# EAGLE board fmc-to-vhcdi (EAGLE 8.3.2), part 1 of 2
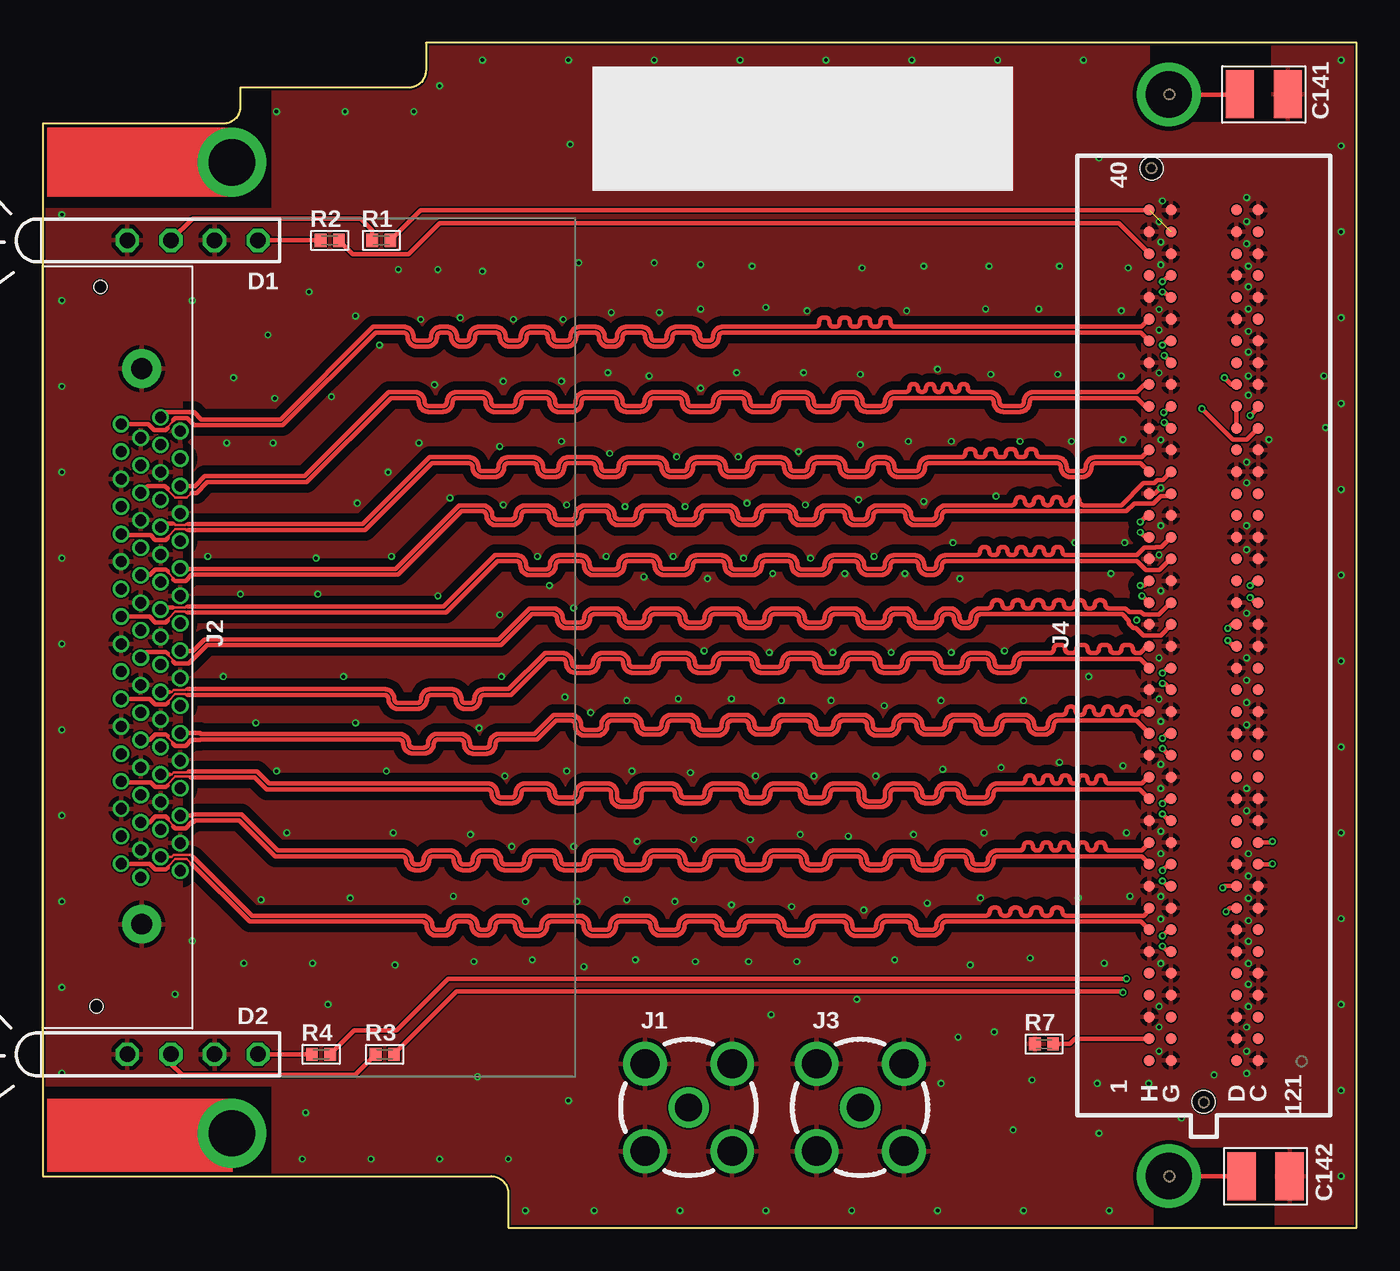
[diagram p2: board, top side]
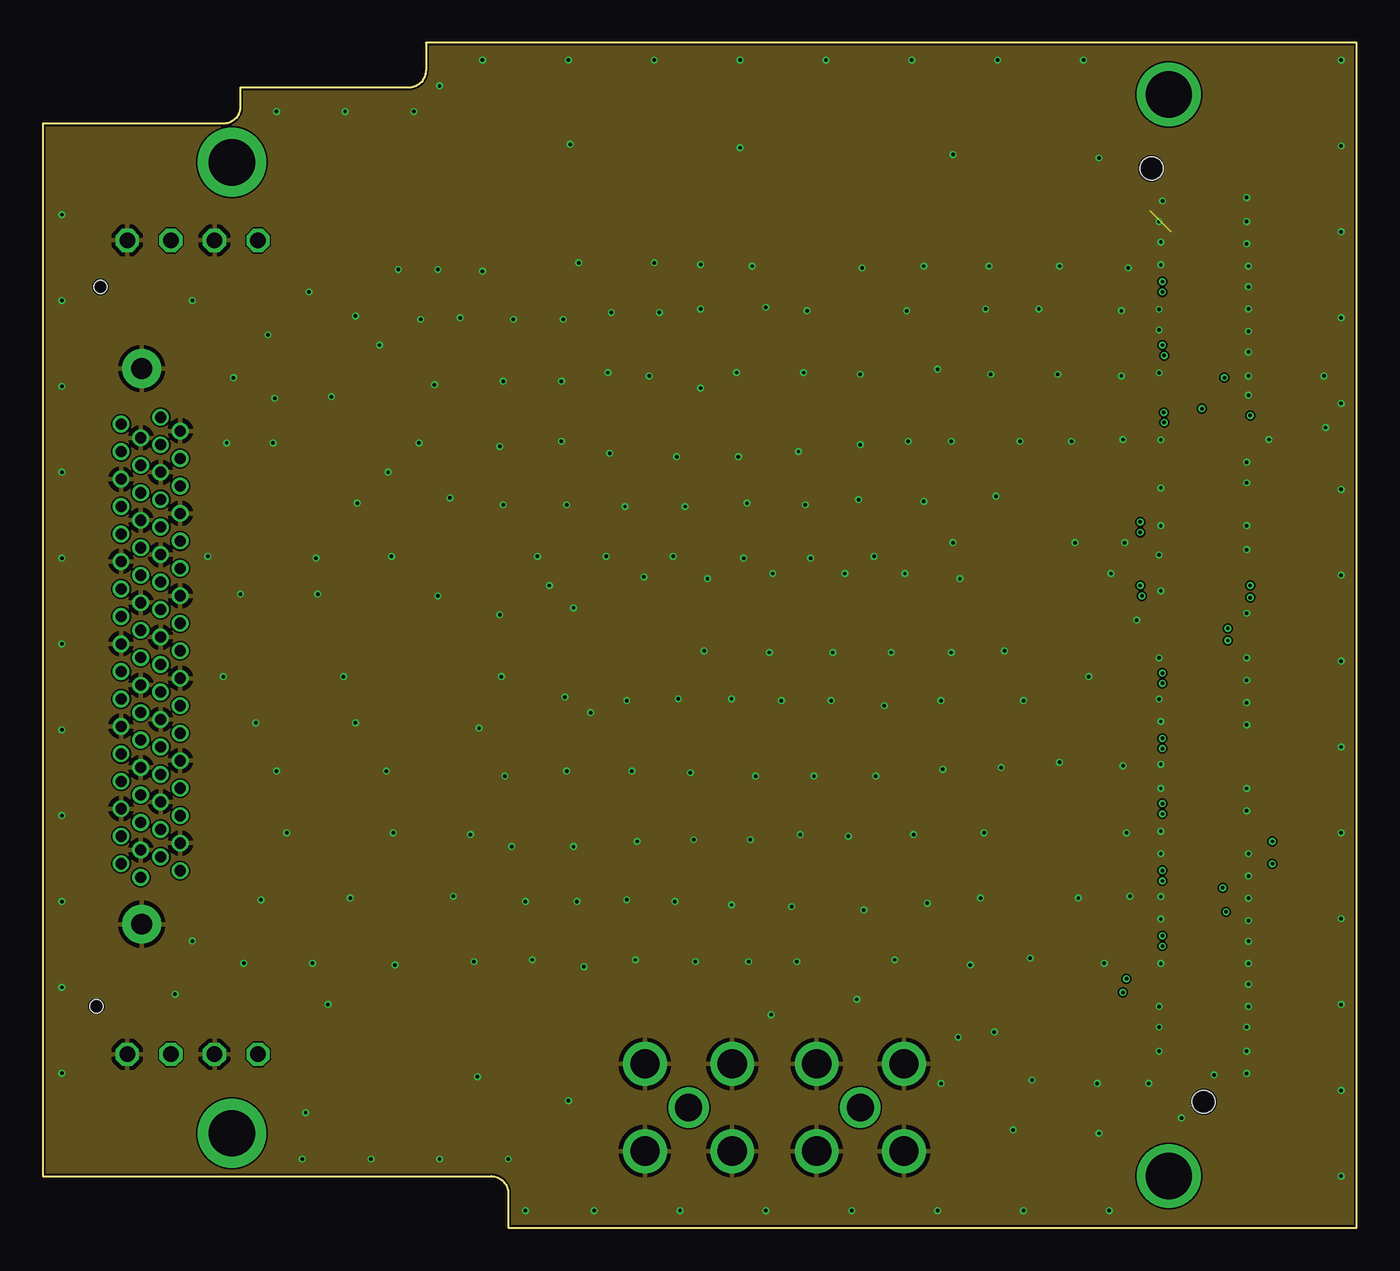
[diagram p3: board, inner layer GND1]
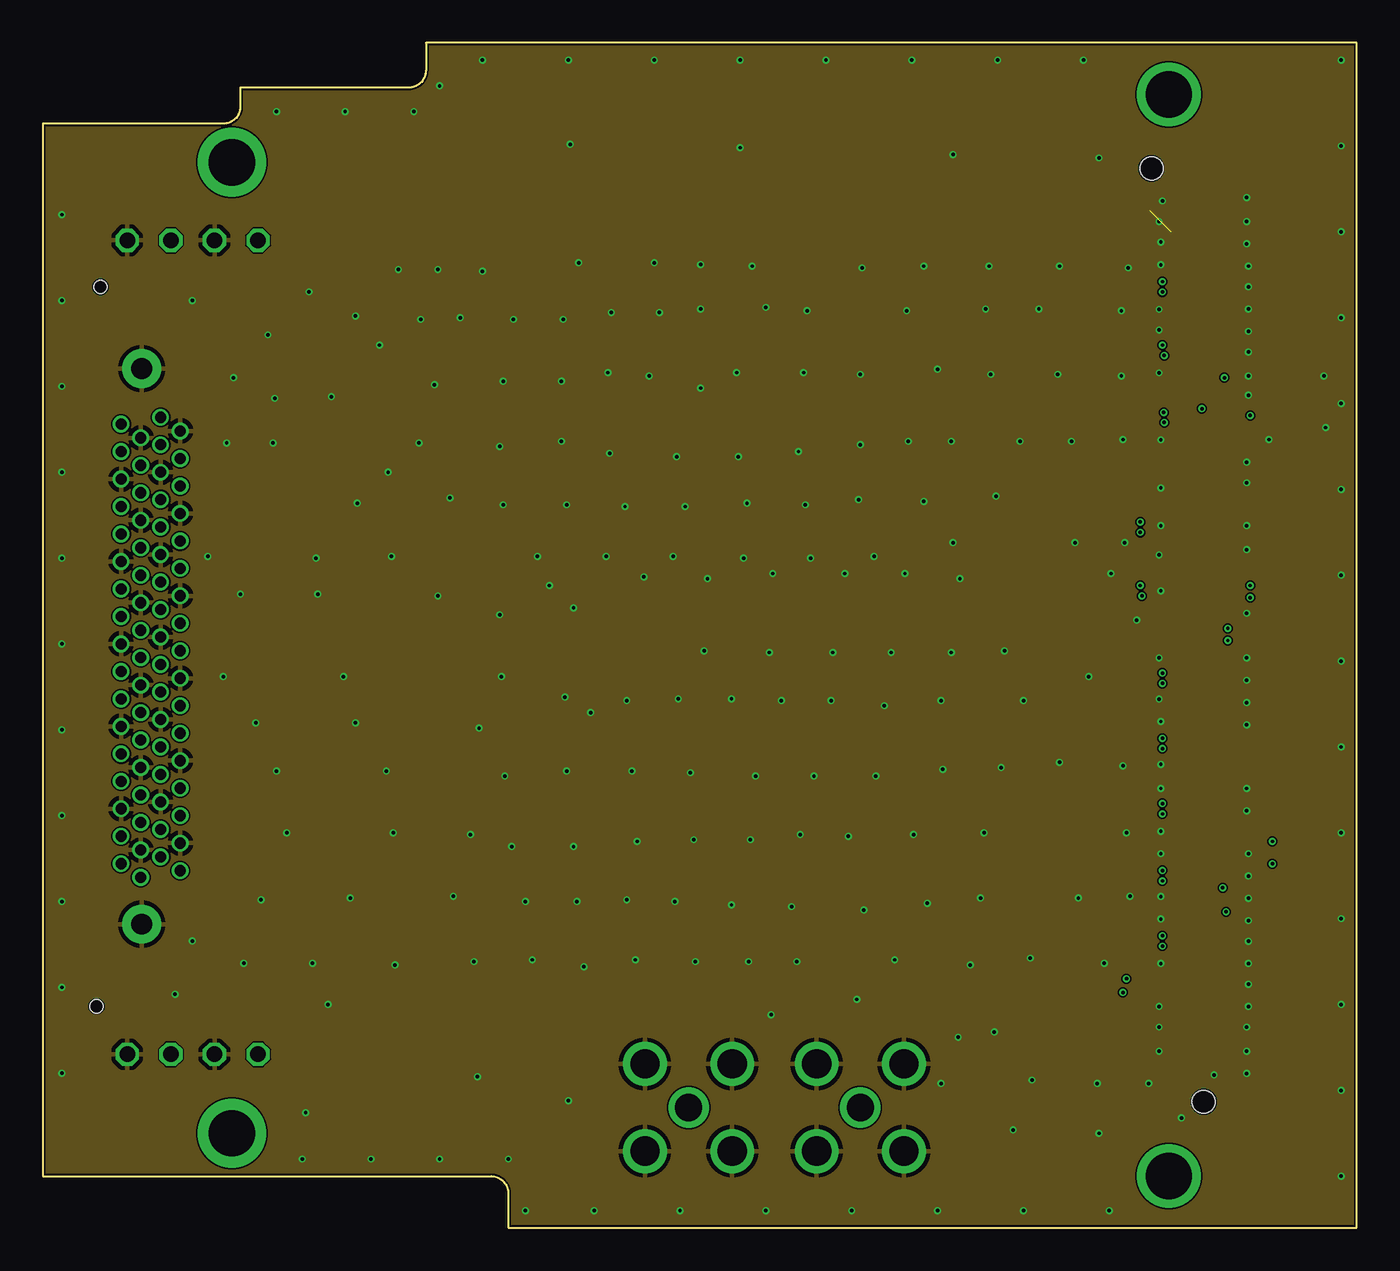
[diagram p4: board, inner layer GND2]
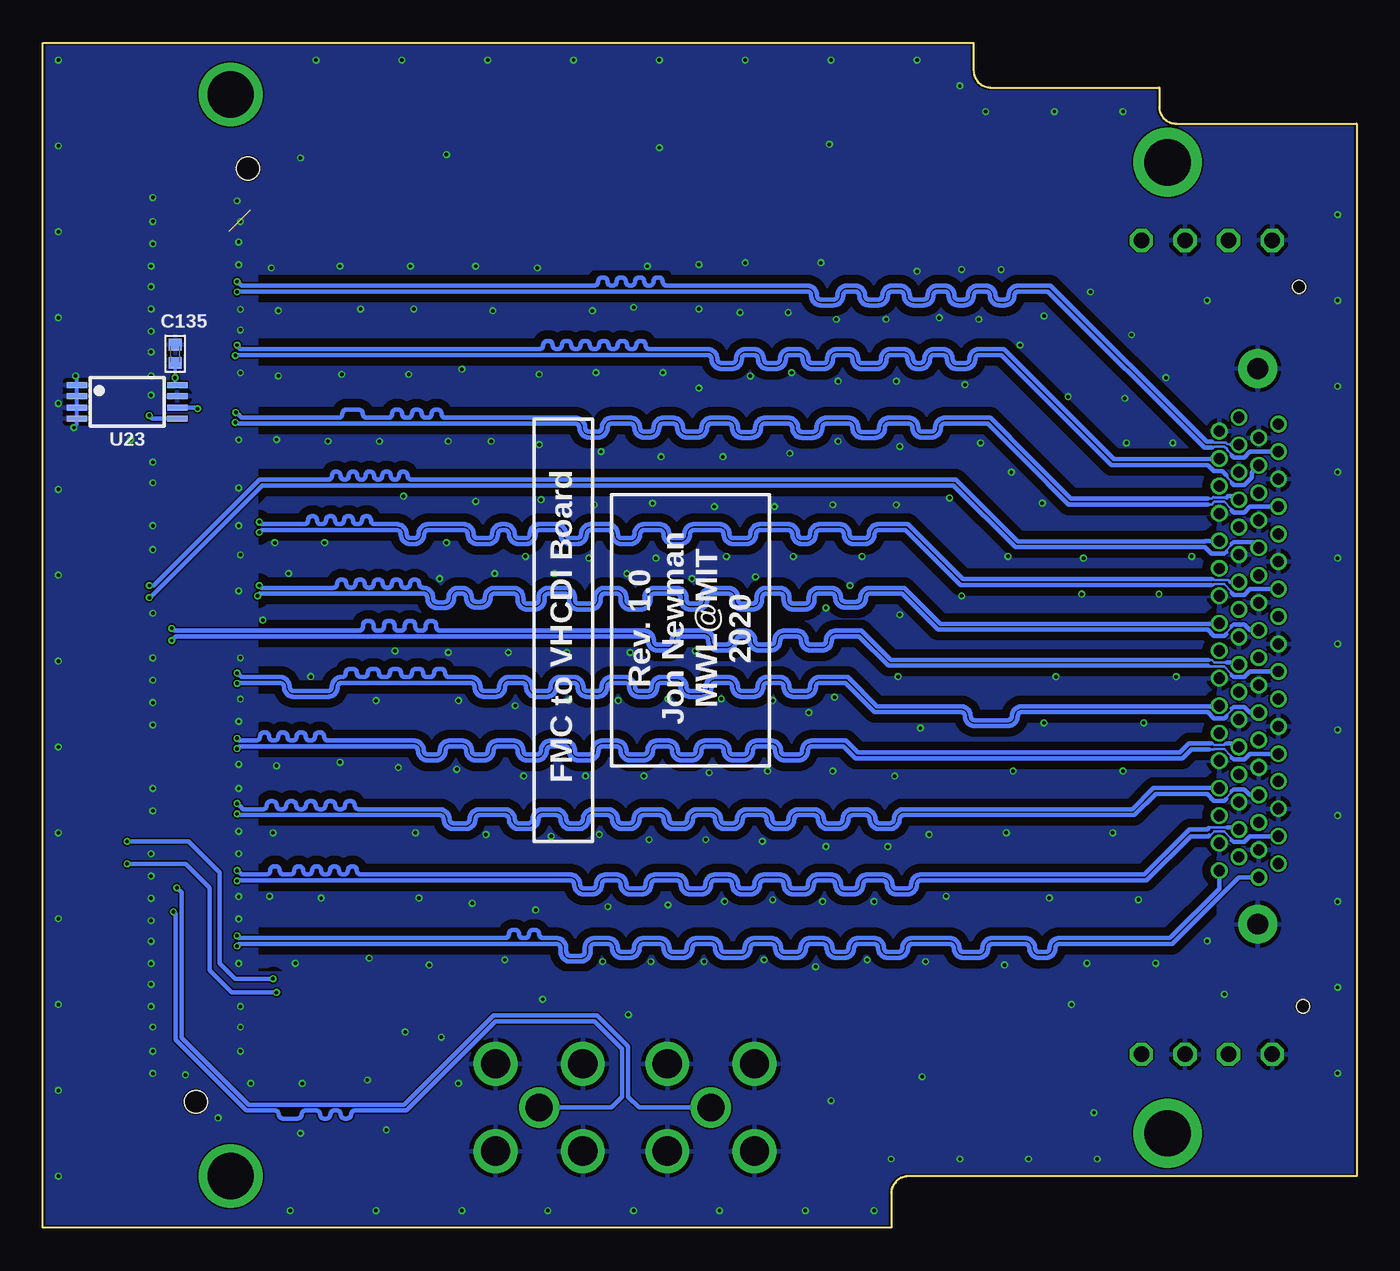
[diagram p5: board, bottom side, seen from below]

Size 76.5 x 69 mm. Coordinates in mm from the lower left corner, seen from the top.
Copper layers (1+2*3+16): Top 0.035mm / dielectric 0.2mm / GND1 0.0175mm / dielectric 1.065mm / GND2 0.0356mm / dielectric 0.2007mm / Bottom 0.035mm
Design rules "jlcpcb-4-layer_JLC7628-stackup *": minimum track width 3.5mil, minimum drill 0.2mm, track to track 3.5mil, track to pad 5mil, pad to pad 5mil, via to via 5mil, smd to smd 0mil, copper to edge 0.1mm, drill to drill 5mil, minimum pad ring 4mil, minimum via ring 4mil, stop-mask expansion 3mil, vias tented up to drill 100mil, thermal gap 10mil
Net classes: 1 100 Ohm Diff Top: width 0.25 mm, drill 0.2 mm, clearance 0.09 mm
tRestrict: area 63.6,1 to 67.6,5; area 63.6,64 to 67.6,68; area 64.7,-2 to 71.7,4.6; area 64.5,64.4 to 71.5,71.1; area -0.4,59.4 to 13.3,68.2; area -0.4,-0.6 to 13.3,8.2

## Footprints (pad centres in the part's own frame; a part is rotated, then mirrored left to right if it is on the bottom)
0402 = smd 0.686 x 0.762: 1 -0.533,0; 2 0.533,0
1210 = smd 1.651 x 2.794: 1 -1.397,0; 2 1.397,0
WP4060VH/2GD_LED_ARRAY = drill 0.9 octagon: A1 -6.35,0; A2 -1.27,0; C1 -8.89,0; C2 -3.81,0
SMA_JACK_142-0701-201 = drill 1.575: CLK 0,0 | drill 1.702: GND$1 -2.54,2.54; GND$2 2.54,2.54; GND$3 -2.54,-2.54; GND$4 2.54,-2.54
0714300008-TIGHT = drill 0.65 pad 0.9: 1 0,0; 2 -0.8,-1.15; 3 -1.6,0; 4 -2.4,-1.15; 5 -3.2,0; 6 -4,-1.15; 7 -4.8,0; 8 -5.6,-1.15; 9 -6.4,0; 10 -7.2,-1.15; 11 -8,0; 12 -8.8,-1.15; 13 -9.6,0; 14 -10.4,-1.15; 15 -11.2,0; 16 -12,-1.15; 17 -12.8,0; 18 -13.6,-1.15; 19 -14.4,0; 20 -15.2,-1.15; 21 -16,0; 22 -16.8,-1.15; 23 -17.6,0; 24 -18.4,-1.15; 25 -19.2,0; 26 -20,-1.15; 27 -20.8,0; 28 -21.6,-1.15; 29 -22.4,0; 30 -23.2,-1.15; 31 -24,0; 32 -24.8,-1.15; 33 -25.6,0; 34 -26.4,-1.15; 35 0.4,-2.3; 36 -0.4,-3.45; 37 -1.2,-2.3; 38 -2,-3.45; 39 -2.8,-2.3; 40 -3.6,-3.45; 41 -4.4,-2.3; 42 -5.2,-3.45; 43 -6,-2.3; 44 -6.8,-3.45; 45 -7.6,-2.3; 46 -8.4,-3.45; 47 -9.2,-2.3; 48 -10,-3.45; 49 -10.8,-2.3; 50 -11.6,-3.45; 51 -12.4,-2.3; 52 -13.2,-3.45; 53 -14,-2.3; 54 -14.8,-3.45; 55 -15.6,-2.3; 56 -16.4,-3.45; 57 -17.2,-2.3; 58 -18,-3.45; 59 -18.8,-2.3; 60 -19.6,-3.45; 61 -20.4,-2.3; 62 -21.2,-3.45; 63 -22,-2.3; 64 -22.8,-3.45; 65 -23.6,-2.3; 66 -24.4,-3.45; 67 -25.2,-2.3; 68 -26,-3.45 | drill 1.2 pad 2.25: MECH1 -29.235,-2.25; MECH2 3.125,-2.25 | hole 0.75: 7.91,-4.88; -33.99,-4.65
FMC_LPC_MALE = smd 0.635 x 0.635: C1 24.765,3.175; C2 23.495,3.175; C3 22.225,3.175; C4 20.955,3.175; C5 19.685,3.175; C6 18.415,3.175; C7 17.145,3.175; C8 15.875,3.175; C9 14.605,3.175; C10 13.335,3.175; C11 12.065,3.175; C12 10.795,3.175; C13 9.525,3.175; C14 8.255,3.175; C15 6.985,3.175; C16 5.715,3.175; C17 4.445,3.175; C18 3.175,3.175; C19 1.905,3.175; C20 0.635,3.175; C21 -0.635,3.175; C22 -1.905,3.175; C23 -3.175,3.175; C24 -4.445,3.175; C25 -5.715,3.175; C26 -6.985,3.175; C27 -8.255,3.175; C28 -9.525,3.175; C29 -10.795,3.175; C30 -12.065,3.175; C31 -13.335,3.175; C32 -14.605,3.175; C33 -15.875,3.175; C34 -17.145,3.175; C35 -18.415,3.175; C36 -19.685,3.175; C37 -20.955,3.175; C38 -22.225,3.175; C39 -23.495,3.175; C40 -24.765,3.175; D1 24.765,1.905; D2 23.495,1.905; D3 22.225,1.905; D4 20.955,1.905; D5 19.685,1.905; D6 18.415,1.905; D7 17.145,1.905; D8 15.875,1.905; D9 14.605,1.905; D10 13.335,1.905; D11 12.065,1.905; D12 10.795,1.905; D13 9.525,1.905; D14 8.255,1.905; D15 6.985,1.905; D16 5.715,1.905; D17 4.445,1.905; D18 3.175,1.905; D19 1.905,1.905; D20 0.635,1.905; D21 -0.635,1.905; D22 -1.905,1.905; D23 -3.175,1.905; D24 -4.445,1.905; D25 -5.715,1.905; D26 -6.985,1.905; D27 -8.255,1.905; D28 -9.525,1.905; D29 -10.795,1.905; D30 -12.065,1.905; D31 -13.335,1.905; D32 -14.605,1.905; D33 -15.875,1.905; D34 -17.145,1.905; D35 -18.415,1.905; D36 -19.685,1.905; D37 -20.955,1.905; D38 -22.225,1.905; D39 -23.495,1.905; D40 -24.765,1.905; G1 24.765,-1.905; G2 23.495,-1.905; G3 22.225,-1.905; G4 20.955,-1.905; G5 19.685,-1.905; G6 18.415,-1.905; G7 17.145,-1.905; G8 15.875,-1.905; G9 14.605,-1.905; G10 13.335,-1.905; G11 12.065,-1.905; G12 10.795,-1.905; G13 9.525,-1.905; G14 8.255,-1.905; G15 6.985,-1.905; G16 5.715,-1.905; G17 4.445,-1.905; G18 3.175,-1.905; G19 1.905,-1.905; G20 0.635,-1.905; G21 -0.635,-1.905; G22 -1.905,-1.905; G23 -3.175,-1.905; G24 -4.445,-1.905; G25 -5.715,-1.905; G26 -6.985,-1.905; G27 -8.255,-1.905; G28 -9.525,-1.905; G29 -10.795,-1.905; G30 -12.065,-1.905; G31 -13.335,-1.905; G32 -14.605,-1.905; G33 -15.875,-1.905; G34 -17.145,-1.905; G35 -18.415,-1.905; G36 -19.685,-1.905; G37 -20.955,-1.905; G38 -22.225,-1.905; G39 -23.495,-1.905; G40 -24.765,-1.905; H1 24.765,-3.175; H2 23.495,-3.175; H3 22.225,-3.175; H4 20.955,-3.175; H5 19.685,-3.175; H6 18.415,-3.175; H7 17.145,-3.175; H8 15.875,-3.175; H9 14.605,-3.175; H10 13.335,-3.175; H11 12.065,-3.175; H12 10.795,-3.175; H13 9.525,-3.175; H14 8.255,-3.175; H15 6.985,-3.175; H16 5.715,-3.175; H17 4.445,-3.175; H18 3.175,-3.175; H19 1.905,-3.175; H20 0.635,-3.175; H21 -0.635,-3.175; H22 -1.905,-3.175; H23 -3.175,-3.175; H24 -4.445,-3.175; H25 -5.715,-3.175; H26 -6.985,-3.175; H27 -8.255,-3.175; H28 -9.525,-3.175; H29 -10.795,-3.175; H30 -12.065,-3.175; H31 -13.335,-3.175; H32 -14.605,-3.175; H33 -15.875,-3.175; H34 -17.145,-3.175; H35 -18.415,-3.175; H36 -19.685,-3.175; H37 -20.955,-3.175; H38 -22.225,-3.175; H39 -23.495,-3.175; H40 -24.765,-3.175 | drill 2.692: CHASSIS_A -31.496,-2.032; CHASSIS_B 31.496,-2.032 | hole 1.321: 27.165,0; -27.191,-3.048
FMC_SINGLE_WIDTH_MODULE = drill 2.7 pad 4: BEZ1 -54.6,59.05; BEZ2 -54.6,2.5
TSSOP8 = smd 0.35 x 1.2: 1 -0.975,-2.925; 2 -0.325,-2.925; 3 0.325,-2.925; 4 0.975,-2.925; 5 0.975,2.925; 6 0.325,2.925; 7 -0.325,2.925; 8 -0.975,2.925

## Placement (x,y rotation side)
C135  0.1uF  [0402]  68.8,50.9 270 bottom
C141  0.1uF, 500V  [1210]  71.1,66 180 top
C142  0.1uF, 500V  [1210]  71.2,3 180 top
D1  569-011x  [WP4060VH/2GD_LED_ARRAY]  13.8,57.5 0 top
D2  569-011x  [WP4060VH/2GD_LED_ARRAY]  13.8,10.1 0 top
J1  [SMA_JACK_142-0701-201]  37.6,7 0 top
J2  0714300008  [0714300008-TIGHT]  8,20.8 270 top
J3  [SMA_JACK_142-0701-201]  47.6,7 0 top
J4  [FMC_LPC_MALE]  67.6,34.5 270 top
J9  FMC_SINGLE_WIDTH_MODULE  [FMC_SINGLE_WIDTH_MODULE]  65.6,3 0 top
R1  300  [0402]  19.7,57.5 0 top
R2  100  [0402]  16.7,57.5 0 top
R3  100  [0402]  19.9,10.1 0 top
R4  100  [0402]  16.2,10.1 0 top
R7  10k  [0402]  58.3,10.7 0 top
U23  24AA64ST  [TSSOP8]  71.6,48.1 270 bottom

## Tracks (layer width: path | path; a pad name or v marks a point on that pad's centre or on a via)
+3V3  (1 unrouted)
  Top 0.25: J4.H40 22,59.27 R1.2
DOUT0_LVDS_N  (via drill 0.2)
  Top 0.25: J4.G7 65.55,17.36 v65.2,17
  Bottom 0.25: J2.1 8,19.74 10.87,16.87 17.3,16.87 arc-90 17.88,16.29 arc90 18.12,16.05 18.48,16.05 arc90 18.72,16.29 arc-90 19.3,16.87 21.21,16.87 arc-90 21.79,16.29 arc90 22.02,16.05 22.88,16.05 arc90 23.12,16.29 arc-90 23.7,16.87 25.88,16.87 arc-90 26.46,16.29 arc90 26.69,16.05 27.28,16.05 arc90 27.52,16.29 arc-90 28.1,16.87 29.02,16.87 arc-90 29.6,16.29 arc90 29.83,16.05 30.28,16.05 arc90 30.52,16.29 arc-90 31.1,16.87 31.81,16.87 arc-90 32.39,16.29 arc90 32.63,16.05 33.28,16.05 arc90 33.52,16.29 arc-90 34.1,16.87 35.06,16.87 arc-90 35.63,16.29 arc90 35.87,16.05 36.78,16.05 arc90 37.02,16.29 arc-90 37.6,16.87 38.43,16.87 arc-90 39.01,16.29 arc90 39.25,16.05 39.78,16.05 arc90 40.02,16.29 arc-90 40.6,16.87 41.51,16.87 arc-90 42.09,16.29 arc90 42.32,16.05 42.78,16.05 arc90 43.02,16.29 arc-90 43.6,16.87 44.37,16.87 arc-90 44.95,16.29 44.95,16.08 arc90 45.19,15.84 45.78,15.84 arc90 46.02,16.08 46.02,16.29 arc-90 46.6,16.87 47.37,16.87 arc90 47.6,17.11 arc-90 47.84,17.34 47.95,17.34 arc-90 48.19,17.11 arc90 48.43,16.87 48.54,16.87 arc90 48.78,17.11 arc-90 49.01,17.34 49.12,17.34 arc-90 49.36,17.11 arc90 49.6,16.87 65.1,16.87 65.2,16.97 v65.2,17
DOUT0_LVDS_P  (via drill 0.2)
  Top 0.25: v65.2,16.4 65.52,16.09 J4.G6
  Bottom 0.25: J2.35 6.86,20.4 10.73,16.53 17.3,16.53 arc-90 17.54,16.29 arc90 18.12,15.71 18.48,15.71 arc90 19.06,16.29 arc-90 19.3,16.53 21.21,16.53 arc-90 21.45,16.29 arc90 22.02,15.71 22.88,15.71 arc90 23.46,16.29 arc-90 23.7,16.53 25.88,16.53 arc-90 26.12,16.29 arc90 26.69,15.71 27.28,15.71 arc90 27.86,16.29 arc-90 28.1,16.53 29.02,16.53 arc-90 29.26,16.29 arc90 29.83,15.71 30.28,15.71 arc90 30.86,16.29 arc-90 31.1,16.53 31.81,16.53 arc-90 32.05,16.29 arc90 32.63,15.71 33.28,15.71 arc90 33.86,16.29 arc-90 34.1,16.53 35.06,16.53 arc-90 35.29,16.29 arc90 35.87,15.71 36.78,15.71 arc90 37.36,16.29 arc-90 37.6,16.53 38.43,16.53 arc-90 38.67,16.29 arc90 39.25,15.71 39.78,15.71 arc90 40.36,16.29 arc-90 40.6,16.53 41.51,16.53 arc-90 41.75,16.29 arc90 42.32,15.71 42.78,15.71 arc90 43.36,16.29 arc-90 43.6,16.53 44.37,16.53 arc-90 44.61,16.29 44.61,16.08 arc90 45.19,15.5 45.78,15.5 arc90 46.36,16.08 46.36,16.29 arc-90 46.6,16.53 65.07,16.53 v65.2,16.4
DOUT1_LVDS_N
  Top 0.14: 8.74,21.6 8.62,21.71 7.8,21.71 7.62,21.71 7.51,21.6 J2.2
  Top 0.25: 64.4,18.47 64.1,18.17 59.6,18.17 arc-90 59.36,18.41 arc90 59.12,18.64 59,18.64 arc90 58.76,18.41 arc-90 58.52,18.17 58.39,18.17 arc-90 58.15,18.41 arc90 57.92,18.64 57.79,18.64 arc90 57.55,18.41 arc-90 57.31,18.17 57.18,18.17 arc-90 56.95,18.41 arc90 56.71,18.64 56.58,18.64 arc90 56.34,18.41 arc-90 56.1,18.17 55.97,18.17 arc-90 55.74,18.41 arc90 55.5,18.64 55.37,18.64 arc90 55.13,18.41 arc-90 54.89,18.17 52.6,18.17 arc90 52.02,17.59 arc-90 51.78,17.36 51.09,17.36 arc-90 50.86,17.59 arc90 50.28,18.17 49.1,18.17 arc90 48.52,17.59 48.52,17.58 arc-90 48.28,17.34 47.37,17.34 arc-90 47.13,17.58 47.13,17.59 arc90 46.56,18.17 45.1,18.17 arc90 44.52,17.59 44.52,17.58 arc-90 44.28,17.34 43.42,17.34 arc-90 43.18,17.58 43.18,17.59 arc90 42.6,18.17 41.1,18.17 arc90 40.52,17.59 arc-90 40.28,17.36 39.79,17.36 arc-90 39.56,17.59 arc90 38.98,18.17 37.6,18.17 arc90 37.02,17.59 arc-90 36.78,17.36 35.95,17.36 arc-90 35.72,17.59 arc90 35.14,18.17 33.6,18.17 arc90 33.02,17.59 33.02,17.58 arc-90 32.78,17.34 32.06,17.34 arc-90 31.82,17.58 31.82,17.59 arc90 31.24,18.17 29.6,18.17 arc90 29.02,17.59 29.02,17.58 arc-90 28.78,17.34 28.08,17.34 arc-90 27.85,17.58 27.85,17.59 arc90 27.27,18.17 26.6,18.17 arc90 26.02,17.59 arc-90 25.78,17.36 25.54,17.36 arc-90 25.31,17.59 arc90 24.73,18.17 24.18,18.17 arc90 23.6,17.59 arc-90 23.37,17.36 22.91,17.36 arc-90 22.68,17.59 arc90 22.1,18.17 12.17,18.17 8.74,21.6 | 64.4,18.47 64.4,18.5 | J4.H8 64.42,18.49 64.4,18.47
DOUT1_LVDS_P
  Top 0.14: 7.26,20.96 7.31,21.02 7.31,21.08 7.72,21.48 8.37,21.48 8.66,21.2
  Top 0.25: J4.H7 63.95,17.83 52.6,17.83 arc90 52.36,17.59 arc-90 51.78,17.02 51.09,17.02 arc-90 50.52,17.59 arc90 50.28,17.83 49.1,17.83 arc90 48.86,17.59 48.86,17.58 arc-90 48.28,17 47.37,17 arc-90 46.79,17.58 46.79,17.59 arc90 46.56,17.83 45.1,17.83 arc90 44.86,17.59 44.86,17.58 arc-90 44.28,17 43.42,17 arc-90 42.84,17.58 42.84,17.59 arc90 42.6,17.83 41.1,17.83 arc90 40.86,17.59 arc-90 40.28,17.02 39.79,17.02 arc-90 39.22,17.59 arc90 38.98,17.83 37.6,17.83 arc90 37.36,17.59 arc-90 36.78,17.02 35.95,17.02 arc-90 35.38,17.59 arc90 35.14,17.83 33.6,17.83 arc90 33.36,17.59 33.36,17.58 arc-90 32.78,17 32.06,17 arc-90 31.48,17.58 31.48,17.59 arc90 31.24,17.83 29.6,17.83 arc90 29.36,17.59 29.36,17.58 arc-90 28.78,17 28.08,17 arc-90 27.51,17.58 27.51,17.59 arc90 27.27,17.83 26.6,17.83 arc90 26.36,17.59 arc-90 25.78,17.02 25.54,17.02 arc-90 24.97,17.59 arc90 24.73,17.83 24.18,17.83 arc90 23.94,17.59 arc-90 23.37,17.02 22.91,17.02 arc-90 22.34,17.59 arc90 22.1,17.83 12.03,17.83 8.66,21.2 | J2.36 6.2,21.2 6.54,20.86 7.16,20.86 7.26,20.96
DOUT2_LVDS_N  (via drill 0.2)
  Top 0.25: v65.2,20.8 65.56,21.16 J4.G10
  Bottom 0.14: 7.3,23.3 7.61,23.3 7.62,23.31 7.71,23.31 7.72,23.32 8.58,23.32 8.6,23.29
  Bottom 0.25: J2.4 6.95,23.3 7.3,23.3 7.53,23.3 | 8.6,23.29 8.69,23.2 9.74,23.2 12.37,20.57 25.36,20.57 arc-90 25.94,19.99 arc90 26.18,19.75 26.78,19.75 arc90 27.02,19.99 arc-90 27.6,20.57 28.49,20.57 arc-90 29.07,19.99 arc90 29.3,19.75 29.78,19.75 arc90 30.02,19.99 arc-90 30.6,20.57 31.37,20.57 arc-90 31.94,19.99 arc90 32.18,19.75 32.78,19.75 arc90 33.02,19.99 arc-90 33.6,20.57 34.49,20.57 arc-90 35.07,19.99 arc90 35.31,19.75 35.78,19.75 arc90 36.02,19.99 arc-90 36.6,20.57 37.35,20.57 arc-90 37.93,19.99 arc90 38.17,19.75 38.78,19.75 arc90 39.02,19.99 arc-90 39.6,20.57 40.83,20.57 arc-90 41.41,19.99 arc90 41.65,19.75 42.28,19.75 arc90 42.52,19.99 arc-90 43.1,20.57 43.71,20.57 arc-90 44.29,19.99 arc90 44.53,19.75 44.98,19.75 arc90 45.22,19.99 arc-90 45.8,20.57 57.98,20.57 arc90 58.22,20.81 arc-90 58.46,21.05 58.5,21.05 arc-90 58.74,20.81 arc90 58.98,20.57 59.02,20.57 arc90 59.26,20.81 arc-90 59.5,21.05 59.54,21.05 arc-90 59.78,20.81 arc90 60.02,20.57 60.06,20.57 arc90 60.3,20.81 arc-90 60.54,21.05 60.58,21.05 arc-90 60.82,20.81 arc90 61.06,20.57 61.1,20.57 arc90 61.34,20.81 arc-90 61.58,21.05 61.62,21.05 arc-90 61.86,20.81 arc90 62.1,20.57 62.48,20.57 arc90 62.71,20.81 arc-90 62.95,21.05 63.02,21.05 arc-90 63.26,20.81 arc90 63.5,20.57 64.93,20.57 65.01,20.65 65.05,20.65 v65.2,20.8
DOUT2_LVDS_P  (via drill 0.2)
  Top 0.25: v65.2,20.2 65.5,19.89 J4.G9
  Bottom 0.14: 8.65,22.8 8.57,22.8 8.28,23.08 7.72,23.08 7.31,22.68 7.31,22.62 7.16,22.46
  Bottom 0.25: v65.2,20.2 65.17,20.23 45.8,20.23 arc90 45.56,19.99 arc-90 44.98,19.41 44.53,19.41 arc-90 43.95,19.99 arc90 43.71,20.23 43.1,20.23 arc90 42.86,19.99 arc-90 42.28,19.41 41.65,19.41 arc-90 41.07,19.99 arc90 40.83,20.23 39.6,20.23 arc90 39.36,19.99 arc-90 38.78,19.41 38.17,19.41 arc-90 37.59,19.99 arc90 37.35,20.23 36.6,20.23 arc90 36.36,19.99 arc-90 35.78,19.41 35.31,19.41 arc-90 34.73,19.99 arc90 34.49,20.23 33.6,20.23 arc90 33.36,19.99 arc-90 32.78,19.41 32.18,19.41 arc-90 31.6,19.99 arc90 31.37,20.23 30.6,20.23 arc90 30.36,19.99 arc-90 29.78,19.41 29.3,19.41 arc-90 28.73,19.99 arc90 28.49,20.23 27.6,20.23 arc90 27.36,19.99 arc-90 26.78,19.41 26.18,19.41 arc-90 25.6,19.99 arc90 25.36,20.23 12.23,20.23 9.66,22.8 8.65,22.8 8.59,22.86 | J2.38 6.2,22.8 6.54,22.46 7.16,22.46 7.26,22.57
DOUT3_LVDS_N
  Top 0.14: 7.36,26.4 7.51,26.4 7.62,26.52 7.71,26.52 7.72,26.52 8.45,26.52 8.5,26.57
  Top 0.25: 7.36,26.4 J2.8 | 8.5,26.57 12.47,26.57 13.17,25.87 25.89,25.87 arc-90 26.47,25.29 arc90 26.71,25.05 27.28,25.05 arc90 27.52,25.29 arc-90 28.1,25.87 29.25,25.87 arc-90 29.83,25.29 arc90 30.06,25.05 30.78,25.05 arc90 31.02,25.29 arc-90 31.6,25.87 32.86,25.87 arc-90 33.43,25.29 33.43,25.08 arc90 33.67,24.84 34.28,24.84 arc90 34.52,25.08 34.52,25.29 arc-90 35.1,25.87 36.56,25.87 arc-90 37.14,25.29 arc90 37.38,25.05 38.28,25.05 arc90 38.52,25.29 arc-90 39.1,25.87 40.4,25.87 arc-90 40.98,25.29 arc90 41.22,25.05 41.78,25.05 arc90 42.02,25.29 arc-90 42.6,25.87 43.84,25.87 arc-90 44.42,25.29 arc90 44.66,25.05 45.28,25.05 arc90 45.52,25.29 arc-90 46.1,25.87 47.27,25.87 arc-90 47.84,25.29 47.84,25.08 arc90 48.08,24.84 48.78,24.84 arc90 49.02,25.08 49.02,25.29 arc-90 49.6,25.87 50.62,25.87 arc-90 51.2,25.29 arc90 51.44,25.05 51.78,25.05 arc90 52.02,25.29 arc-90 52.6,25.87 53.07,25.87 arc-90 53.64,25.29 arc90 53.88,25.05 54.78,25.05 arc90 55.02,25.29 arc-90 55.6,25.87 56.97,25.87 arc90 57.21,26.11 arc-90 57.45,26.34 57.49,26.34 arc-90 57.73,26.11 arc90 57.97,25.87 58.01,25.87 arc90 58.24,26.11 arc-90 58.48,26.34 58.52,26.34 arc-90 58.76,26.11 arc90 59,25.87 59.04,25.87 arc90 59.28,26.11 arc-90 59.52,26.34 59.56,26.34 arc-90 59.79,26.11 arc90 60.03,25.87 60.07,25.87 arc90 60.31,26.11 arc-90 60.55,26.34 60.59,26.34 arc-90 60.83,26.11 arc90 61.07,25.87 61.11,25.87 arc90 61.35,26.11 arc-90 61.58,26.34 61.62,26.34 arc-90 61.86,26.11 arc90 62.1,25.87 64,25.87 64.38,26.25 J4.H14
DOUT3_LVDS_P
  Top 0.14: 7.26,25.77 7.26,25.83 7.72,26.29 8.55,26.29 8.6,26.23
  Top 0.25: 8.6,26.23 12.33,26.23 13.03,25.53 25.89,25.53 arc-90 26.13,25.29 arc90 26.71,24.71 27.28,24.71 arc90 27.86,25.29 arc-90 28.1,25.53 29.25,25.53 arc-90 29.49,25.29 arc90 30.06,24.71 30.78,24.71 arc90 31.36,25.29 arc-90 31.6,25.53 32.86,25.53 arc-90 33.09,25.29 33.09,25.08 arc90 33.67,24.5 34.28,24.5 arc90 34.86,25.08 34.86,25.29 arc-90 35.1,25.53 36.56,25.53 arc-90 36.8,25.29 arc90 37.38,24.71 38.28,24.71 arc90 38.86,25.29 arc-90 39.1,25.53 40.4,25.53 arc-90 40.64,25.29 arc90 41.22,24.71 41.78,24.71 arc90 42.36,25.29 arc-90 42.6,25.53 43.84,25.53 arc-90 44.08,25.29 arc90 44.66,24.71 45.28,24.71 arc90 45.86,25.29 arc-90 46.1,25.53 47.27,25.53 arc-90 47.5,25.29 47.5,25.08 arc90 48.08,24.5 48.78,24.5 arc90 49.36,25.08 49.36,25.29 arc-90 49.6,25.53 50.62,25.53 arc-90 50.86,25.29 arc90 51.44,24.71 51.78,24.71 arc90 52.36,25.29 arc-90 52.6,25.53 53.07,25.53 arc-90 53.3,25.29 arc90 53.88,24.71 54.78,24.71 arc90 55.36,25.29 arc-90 55.6,25.53 63.87,25.53 J4.H13 | 7.26,25.77 7.16,25.66 6.54,25.66 6.26,25.94 4.61,25.94 J2.42
DOUT4_LVDS_N  (via drill 0.2)
  Top 0.25: J4.G13 65.47,24.98 v65.2,24.7
  Bottom 0.25: J2.7 11.84,25.6 13.07,24.37 26.37,24.37 arc-90 26.95,23.79 arc90 27.19,23.55 27.78,23.55 arc90 28.02,23.79 arc-90 28.6,24.37 29.35,24.37 arc-90 29.93,23.79 arc90 30.16,23.55 30.78,23.55 arc90 31.02,23.79 arc-90 31.6,24.37 32.51,24.37 arc-90 33.09,23.79 arc90 33.32,23.55 33.78,23.55 arc90 34.02,23.79 arc-90 34.6,24.37 35.51,24.37 arc-90 36.08,23.79 arc90 36.32,23.55 36.78,23.55 arc90 37.02,23.79 arc-90 37.6,24.37 38.4,24.37 arc-90 38.98,23.79 arc90 39.22,23.55 39.78,23.55 arc90 40.02,23.79 arc-90 40.6,24.37 41.52,24.37 arc-90 42.1,23.79 arc90 42.34,23.55 42.78,23.55 arc90 43.02,23.79 arc-90 43.6,24.37 44.48,24.37 arc-90 45.06,23.79 arc90 45.3,23.55 45.78,23.55 arc90 46.02,23.79 arc-90 46.6,24.37 47.41,24.37 arc-90 47.99,23.79 arc90 48.23,23.55 48.78,23.55 arc90 49.02,23.79 arc-90 49.6,24.37 51.08,24.37 arc-90 51.65,23.79 arc90 51.89,23.55 52.58,23.55 arc90 52.82,23.79 arc-90 53.4,24.37 58.1,24.37 arc90 58.34,24.61 arc-90 58.58,24.84 58.67,24.84 arc-90 58.91,24.61 arc90 59.15,24.37 59.24,24.37 arc90 59.48,24.61 arc-90 59.71,24.84 59.81,24.84 arc-90 60.05,24.61 arc90 60.28,24.37 60.38,24.37 arc90 60.62,24.61 arc-90 60.85,24.84 60.95,24.84 arc-90 61.18,24.61 arc90 61.42,24.37 61.52,24.37 arc90 61.75,24.61 arc-90 61.99,24.84 62.09,24.84 arc-90 62.32,24.61 arc90 62.56,24.37 62.66,24.37 arc90 62.89,24.61 arc-90 63.13,24.84 63.22,24.84 arc-90 63.46,24.61 arc90 63.7,24.37 64.83,24.37 65.01,24.55 65.05,24.55 v65.2,24.7
DOUT4_LVDS_P  (via drill 0.2)
  Top 0.25: J4.G12 65.59,23.7 v65.2,24.1
  Bottom 0.14: 7.26,25.43 7.31,25.38 7.31,25.32 7.59,25.04 7.59,24.96
  Bottom 0.25: v65.2,24.1 65.13,24.03 53.4,24.03 arc90 53.16,23.79 arc-90 52.58,23.21 51.89,23.21 arc-90 51.31,23.79 arc90 51.08,24.03 49.6,24.03 arc90 49.36,23.79 arc-90 48.78,23.21 48.23,23.21 arc-90 47.65,23.79 arc90 47.41,24.03 46.6,24.03 arc90 46.36,23.79 arc-90 45.78,23.21 45.3,23.21 arc-90 44.72,23.79 arc90 44.48,24.03 43.6,24.03 arc90 43.36,23.79 arc-90 42.78,23.21 42.34,23.21 arc-90 41.76,23.79 arc90 41.52,24.03 40.6,24.03 arc90 40.36,23.79 arc-90 39.78,23.21 39.22,23.21 arc-90 38.64,23.79 arc90 38.4,24.03 37.6,24.03 arc90 37.36,23.79 arc-90 36.78,23.21 36.32,23.21 arc-90 35.74,23.79 arc90 35.51,24.03 34.6,24.03 arc90 34.36,23.79 arc-90 33.78,23.21 33.32,23.21 arc-90 32.75,23.79 arc90 32.51,24.03 31.6,24.03 arc90 31.36,23.79 arc-90 30.78,23.21 30.16,23.21 arc-90 29.59,23.79 arc90 29.35,24.03 28.6,24.03 arc90 28.36,23.79 arc-90 27.78,23.21 27.19,23.21 arc-90 26.61,23.79 arc90 26.37,24.03 12.93,24.03 11.7,25.26 8.71,25.26 8.31,24.86 7.69,24.86 7.59,24.96 | J2.41 6.2,25.2 6.54,25.54 7.16,25.54 7.26,25.43
DOUT5_LVDS_N
  Top 0.25: J2.5 8.66,24 8.73,24.07 11.57,24.07 13.67,21.97 20.9,21.97 arc-90 21.48,21.39 arc90 21.71,21.16 21.92,21.16 arc90 22.16,21.39 arc-90 22.73,21.97 23.69,21.97 arc-90 24.26,21.39 arc90 24.5,21.16 24.78,21.16 arc90 25.02,21.39 arc-90 25.6,21.97 26.11,21.97 arc-90 26.69,21.39 arc90 26.92,21.16 27.78,21.16 arc90 28.02,21.39 arc-90 28.6,21.97 29.59,21.97 arc-90 30.16,21.39 arc90 30.4,21.16 31.28,21.16 arc90 31.52,21.39 arc-90 32.1,21.97 33.13,21.97 arc-90 33.7,21.39 arc90 33.94,21.16 34.78,21.16 arc90 35.02,21.39 arc-90 35.6,21.97 36.83,21.97 arc-90 37.41,21.39 arc90 37.65,21.16 38.28,21.16 arc90 38.52,21.39 arc-90 39.1,21.97 40.19,21.97 arc-90 40.77,21.39 arc90 41,21.16 41.78,21.16 arc90 42.02,21.39 arc-90 42.6,21.97 43.91,21.97 arc-90 44.49,21.39 arc90 44.73,21.16 45.28,21.16 arc90 45.52,21.39 arc-90 46.1,21.97 47.4,21.97 arc-90 47.98,21.39 arc90 48.22,21.16 48.78,21.16 arc90 49.02,21.39 arc-90 49.6,21.97 50.41,21.97 arc-90 50.99,21.39 arc90 51.23,21.16 51.78,21.16 arc90 52.02,21.39 arc-90 52.6,21.97 53.54,21.97 arc-90 54.12,21.39 arc90 54.35,21.16 54.78,21.16 arc90 55.02,21.39 arc-90 55.6,21.97 56.88,21.97 arc90 57.12,22.21 arc-90 57.36,22.45 57.41,22.45 arc-90 57.64,22.21 arc90 57.88,21.97 57.93,21.97 arc90 58.17,22.21 arc-90 58.41,22.45 58.46,22.45 arc-90 58.7,22.21 arc90 58.94,21.97 58.99,21.97 arc90 59.23,22.21 arc-90 59.46,22.45 59.52,22.45 arc-90 59.75,22.21 arc90 59.99,21.97 60.04,21.97 arc90 60.28,22.21 arc-90 60.52,22.45 60.57,22.45 arc-90 60.81,22.21 arc90 61.05,21.97 61.1,21.97 arc90 61.33,22.21 arc-90 61.57,22.45 61.62,22.45 arc-90 61.86,22.21 arc90 62.1,21.97 64,21.97 64.42,22.39 J4.H11
DOUT5_LVDS_P
  Top 0.14: 7.26,23.84 7.31,23.78 7.31,23.72 7.59,23.44 7.59,23.36
  Top 0.25: J4.H10 64.42,21.2 64,21.63 55.6,21.63 arc90 55.36,21.39 arc-90 54.78,20.82 54.35,20.82 arc-90 53.78,21.39 arc90 53.54,21.63 52.6,21.63 arc90 52.36,21.39 arc-90 51.78,20.82 51.23,20.82 arc-90 50.65,21.39 arc90 50.41,21.63 49.6,21.63 arc90 49.36,21.39 arc-90 48.78,20.82 48.22,20.82 arc-90 47.64,21.39 arc90 47.4,21.63 46.1,21.63 arc90 45.86,21.39 arc-90 45.28,20.82 44.73,20.82 arc-90 44.15,21.39 arc90 43.91,21.63 42.6,21.63 arc90 42.36,21.39 arc-90 41.78,20.82 41,20.82 arc-90 40.43,21.39 arc90 40.19,21.63 39.1,21.63 arc90 38.86,21.39 arc-90 38.28,20.82 37.65,20.82 arc-90 37.07,21.39 arc90 36.83,21.63 35.6,21.63 arc90 35.36,21.39 arc-90 34.78,20.82 33.94,20.82 arc-90 33.36,21.39 arc90 33.13,21.63 32.1,21.63 arc90 31.86,21.39 arc-90 31.28,20.82 30.4,20.82 arc-90 29.82,21.39 arc90 29.59,21.63 28.6,21.63 arc90 28.36,21.39 arc-90 27.78,20.82 26.92,20.82 arc-90 26.35,21.39 arc90 26.11,21.63 25.6,21.63 arc90 25.36,21.39 arc-90 24.78,20.82 24.5,20.82 arc-90 23.92,21.39 arc90 23.69,21.63 22.73,21.63 arc90 22.5,21.39 arc-90 21.92,20.82 21.71,20.82 arc-90 21.14,21.39 arc90 20.9,21.63 13.53,21.63 11.43,23.73 8.87,23.73 8.74,23.6 8.65,23.6 8.31,23.26 7.69,23.26 7.59,23.36 | J2.39 6.2,23.6 6.54,23.94 7.16,23.94 7.26,23.84
DOUT6_LVDS_N  (via drill 0.2)
  Top 0.25: v65.2,28.5 65.48,28.79 J4.G16
  Bottom 0.14: 7.55,28.2 7.63,28.2 7.72,28.12 8.28,28.12 8.37,28.2 8.5,28.2
  Bottom 0.25: 7.1,28.2 6.9,28 J2.10 7.05,28.2 7.55,28.2 | v65.2,28.5 65.07,28.37 64.1,28.37 arc-90 63.86,28.61 arc90 63.62,28.84 63.57,28.84 arc90 63.33,28.61 arc-90 63.09,28.37 63.03,28.37 arc-90 62.79,28.61 arc90 62.56,28.84 62.5,28.84 arc90 62.26,28.61 arc-90 62.02,28.37 61.96,28.37 arc-90 61.73,28.61 arc90 61.49,28.84 61.43,28.84 arc90 61.19,28.61 arc-90 60.95,28.37 60.9,28.37 arc-90 60.66,28.61 arc90 60.42,28.84 60.36,28.84 arc90 60.12,28.61 arc-90 59.89,28.37 54.9,28.37 arc90 54.32,27.79 arc-90 54.08,27.55 53.63,27.55 arc-90 53.39,27.79 arc90 52.81,28.37 52.1,28.37 arc90 51.52,27.79 arc-90 51.28,27.55 50.83,27.55 arc-90 50.59,27.79 arc90 50.02,28.37 49.1,28.37 arc90 48.52,27.79 arc-90 48.28,27.55 47.74,27.55 arc-90 47.5,27.79 arc90 46.92,28.37 46.1,28.37 arc90 45.52,27.79 arc-90 45.28,27.55 44.73,27.55 arc-90 44.49,27.79 arc90 43.91,28.37 43.1,28.37 arc90 42.52,27.79 arc-90 42.28,27.55 41.54,27.55 arc-90 41.3,27.79 arc90 40.73,28.37 40.1,28.37 arc90 39.52,27.79 arc-90 39.28,27.55 38.73,27.55 arc-90 38.49,27.79 arc90 37.91,28.37 37.1,28.37 arc90 36.52,27.79 arc-90 36.28,27.55 35.73,27.55 arc-90 35.49,27.79 arc90 34.91,28.37 34.1,28.37 arc90 33.52,27.79 arc-90 33.28,27.55 32.53,27.55 arc-90 32.29,27.79 arc90 31.71,28.37 29.73,28.37 29.03,27.67 10.3,27.67 9.77,28.2 8.5,28.2 8.45,28.2
DOUT6_LVDS_P  (via drill 0.2)
  Top 0.25: v65.2,27.9 65.58,27.52 J4.G15
  Bottom 0.14: 8.59,27.86 8.31,27.86 8.28,27.88 7.72,27.88 7.31,27.48 7.31,27.42 7.16,27.26
  Bottom 0.25: v65.2,27.9 65.07,28.03 54.9,28.03 arc90 54.66,27.79 arc-90 54.08,27.21 53.63,27.21 arc-90 53.05,27.79 arc90 52.81,28.03 52.1,28.03 arc90 51.86,27.79 arc-90 51.28,27.21 50.83,27.21 arc-90 50.25,27.79 arc90 50.02,28.03 49.1,28.03 arc90 48.86,27.79 arc-90 48.28,27.21 47.74,27.21 arc-90 47.16,27.79 arc90 46.92,28.03 46.1,28.03 arc90 45.86,27.79 arc-90 45.28,27.21 44.73,27.21 arc-90 44.15,27.79 arc90 43.91,28.03 43.1,28.03 arc90 42.86,27.79 arc-90 42.28,27.21 41.54,27.21 arc-90 40.96,27.79 arc90 40.73,28.03 40.1,28.03 arc90 39.86,27.79 arc-90 39.28,27.21 38.73,27.21 arc-90 38.15,27.79 arc90 37.91,28.03 37.1,28.03 arc90 36.86,27.79 arc-90 36.28,27.21 35.73,27.21 arc-90 35.15,27.79 arc90 34.91,28.03 34.1,28.03 arc90 33.86,27.79 arc-90 33.28,27.21 32.53,27.21 arc-90 31.95,27.79 arc90 31.71,28.03 29.87,28.03 29.17,27.33 23.2,27.33 | 7.26,27.36 7.16,27.26 6.54,27.26 6.2,27.6 J2.44 | 8.59,27.86 9.63,27.86 10.16,27.33 23.2,27.33 | 23.2,27.33 23.17,27.33
DOUT7_LVDS_N
  Top 0.25: J2.11 9.17,28.8 9.2,28.77 20.74,28.77 arc-90 21.32,28.19 arc90 21.56,27.95 22.18,27.95 arc90 22.42,28.19 arc-90 23,28.77 24.29,28.77 arc-90 24.87,28.19 24.87,28.18 arc90 25.11,27.94 25.78,27.94 arc90 26.02,28.18 26.02,28.19 arc-90 26.6,28.77 28.63,28.77 29.73,29.87 30.76,29.87 arc-90 31.33,29.29 31.33,29.24 arc90 31.57,29 32.28,29 arc90 32.52,29.24 32.52,29.29 arc-90 33.1,29.87 34.3,29.87 arc-90 34.87,29.29 arc90 35.11,29.05 35.78,29.05 arc90 36.02,29.29 arc-90 36.6,29.87 37.62,29.87 arc-90 38.2,29.29 38.2,29.24 arc90 38.44,29 39.28,29 arc90 39.52,29.24 39.52,29.29 arc-90 40.1,29.87 40.86,29.87 arc-90 41.44,29.29 arc90 41.68,29.05 42.28,29.05 arc90 42.52,29.29 arc-90 43.1,29.87 44.45,29.87 arc-90 45.03,29.29 arc90 45.27,29.05 45.78,29.05 arc90 46.02,29.29 arc-90 46.6,29.87 47.75,29.87 arc-90 48.32,29.29 48.32,29.24 arc90 48.56,29 49.28,29 arc90 49.52,29.24 49.52,29.29 arc-90 50.1,29.87 50.63,29.87 arc-90 51.2,29.29 arc90 51.44,29.05 52.28,29.05 arc90 52.52,29.29 arc-90 53.1,29.87 54.07,29.87 arc-90 54.65,29.29 arc90 54.88,29.05 55.28,29.05 arc90 55.52,29.29 arc-90 56.1,29.87 57.14,29.87 arc-90 57.72,29.29 arc90 57.96,29.05 58.28,29.05 arc90 58.52,29.29 arc-90 59.1,29.87 59.36,29.87 arc90 59.59,30.11 arc-90 59.83,30.34 59.89,30.34 arc-90 60.13,30.11 arc90 60.37,29.87 60.43,29.87 arc90 60.67,30.11 arc-90 60.91,30.34 60.97,30.34 arc-90 61.21,30.11 arc90 61.45,29.87 61.51,29.87 arc90 61.75,30.11 arc-90 61.98,30.34 62.05,30.34 arc-90 62.29,30.11 arc90 62.52,29.87 62.59,29.87 arc90 62.82,30.11 arc-90 63.06,30.34 63.12,30.34 arc-90 63.36,30.11 arc90 63.6,29.87 63.7,29.87 63.88,30.05 J4.H17 64.28,30.05
DOUT7_LVDS_P
  Top 0.14: 7.26,28.64 7.26,28.56 7.53,28.28 7.53,28.22 7.59,28.16
  Top 0.25: J4.H16 63.68,29.53 59.1,29.53 arc90 58.86,29.29 arc-90 58.28,28.71 57.96,28.71 arc-90 57.38,29.29 arc90 57.14,29.53 56.1,29.53 arc90 55.86,29.29 arc-90 55.28,28.71 54.88,28.71 arc-90 54.31,29.29 arc90 54.07,29.53 53.1,29.53 arc90 52.86,29.29 arc-90 52.28,28.71 51.44,28.71 arc-90 50.86,29.29 arc90 50.63,29.53 50.1,29.53 arc90 49.86,29.29 49.86,29.24 arc-90 49.28,28.66 48.56,28.66 arc-90 47.98,29.24 47.98,29.29 arc90 47.75,29.53 46.6,29.53 arc90 46.36,29.29 arc-90 45.78,28.71 45.27,28.71 arc-90 44.69,29.29 arc90 44.45,29.53 43.1,29.53 arc90 42.86,29.29 arc-90 42.28,28.71 41.68,28.71 arc-90 41.1,29.29 arc90 40.86,29.53 40.1,29.53 arc90 39.86,29.29 39.86,29.24 arc-90 39.28,28.66 38.44,28.66 arc-90 37.86,29.24 37.86,29.29 arc90 37.62,29.53 36.6,29.53 arc90 36.36,29.29 arc-90 35.78,28.71 35.11,28.71 arc-90 34.53,29.29 arc90 34.3,29.53 33.1,29.53 arc90 32.86,29.29 32.86,29.24 arc-90 32.28,28.66 31.57,28.66 arc-90 30.99,29.24 30.99,29.29 arc90 30.76,29.53 29.87,29.53 28.77,28.43 26.6,28.43 arc90 26.36,28.19 26.36,28.18 arc-90 25.78,27.6 25.11,27.6 arc-90 24.53,28.18 24.53,28.19 arc90 24.29,28.43 23,28.43 arc90 22.76,28.19 arc-90 22.18,27.61 21.56,27.61 arc-90 20.98,28.19 arc90 20.74,28.43 9.2,28.43 9.17,28.4 8.65,28.4 8.31,28.06 7.69,28.06 7.59,28.16 | J2.45 6.2,28.4 6.54,28.74 7.16,28.74 7.26,28.64
DOUT8_LVDS_N  (via drill 0.2)
  Top 0.25: J4.G19 65.49,32.59 v65.2,32.3
  Bottom 0.25: J2.13 8.03,30.37 19.5,30.37 arc-90 20.08,29.79 arc90 20.31,29.55 22.23,29.55 arc90 22.47,29.79 arc-90 23.05,30.37 27.93,30.37 29.63,32.07 31.25,32.07 arc-90 31.83,31.49 arc90 32.07,31.25 32.78,31.25 arc90 33.02,31.49 arc-90 33.6,32.07 34.31,32.07 arc-90 34.89,31.49 arc90 35.13,31.25 35.78,31.25 arc90 36.02,31.49 arc-90 36.6,32.07 37.32,32.07 arc-90 37.9,31.49 arc90 38.14,31.25 38.78,31.25 arc90 39.02,31.49 arc-90 39.6,32.07 40.48,32.07 arc-90 41.06,31.49 arc90 41.3,31.25 41.78,31.25 arc90 42.02,31.49 arc-90 42.6,32.07 43.4,32.07 arc-90 43.97,31.49 arc90 44.21,31.25 44.78,31.25 arc90 45.02,31.49 arc-90 45.6,32.07 46.36,32.07 arc-90 46.93,31.49 arc90 47.17,31.25 47.78,31.25 arc90 48.02,31.49 arc-90 48.6,32.07 49.35,32.07 arc-90 49.93,31.49 arc90 50.17,31.25 50.78,31.25 arc90 51.02,31.49 arc-90 51.6,32.07 52.84,32.07 arc90 53.08,32.31 arc-90 53.32,32.55 53.49,32.55 arc-90 53.72,32.31 arc90 53.96,32.07 54.13,32.07 arc90 54.37,32.31 arc-90 54.6,32.55 54.77,32.55 arc-90 55.01,32.31 arc90 55.25,32.07 55.41,32.07 arc90 55.65,32.31 arc-90 55.89,32.55 56.06,32.55 arc-90 56.29,32.31 arc90 56.53,32.07 56.7,32.07 arc90 56.93,32.31 arc-90 57.17,32.55 57.34,32.55 arc-90 57.58,32.31 arc90 57.81,32.07 57.98,32.07 arc90 58.22,32.31 arc-90 58.46,32.55 58.62,32.55 arc-90 58.86,32.31 arc90 59.1,32.07 arc-90 59.68,31.49 arc90 59.91,31.25 61.89,31.25 arc90 62.13,31.49 arc-90 62.7,32.07 64.93,32.07 65.01,32.15 65.05,32.15 v65.2,32.3
DOUT8_LVDS_P  (via drill 0.2)
  Top 0.25: v65.2,31.7 65.32,31.7 J4.G18
  Bottom 0.14: 7.69,29.66 7.53,29.82 7.53,29.88 7.26,30.16 7.26,30.23
  Bottom 0.25: v65.2,31.7 65.17,31.73 62.7,31.73 arc90 62.47,31.49 arc-90 61.89,30.91 59.91,30.91 arc-90 59.34,31.49 arc90 59.1,31.73 51.6,31.73 arc90 51.36,31.49 arc-90 50.78,30.91 50.17,30.91 arc-90 49.59,31.49 arc90 49.35,31.73 48.6,31.73 arc90 48.36,31.49 arc-90 47.78,30.91 47.17,30.91 arc-90 46.59,31.49 arc90 46.36,31.73 45.6,31.73 arc90 45.36,31.49 arc-90 44.78,30.91 44.21,30.91 arc-90 43.63,31.49 arc90 43.4,31.73 42.6,31.73 arc90 42.36,31.49 arc-90 41.78,30.91 41.3,30.91 arc-90 40.72,31.49 arc90 40.48,31.73 39.6,31.73 arc90 39.36,31.49 arc-90 38.78,30.91 38.14,30.91 arc-90 37.56,31.49 arc90 37.32,31.73 36.6,31.73 arc90 36.36,31.49 arc-90 35.78,30.91 35.13,30.91 arc-90 34.55,31.49 arc90 34.31,31.73 33.6,31.73 arc90 33.36,31.49 arc-90 32.78,30.91 32.07,30.91 arc-90 31.49,31.49 arc90 31.25,31.73 29.77,31.73 28.07,30.03 23.05,30.03 arc90 22.81,29.79 arc-90 22.23,29.21 20.31,29.21 arc-90 19.74,29.79 arc90 19.5,30.03 8.68,30.03 8.31,29.66 7.69,29.66 7.59,29.77 | J2.47 6.2,30 6.54,30.34 7.16,30.34 7.26,30.23
DOUT9_LVDS_N
  Top 0.14: 8.42,31.37 8.34,31.37 8.28,31.32 7.72,31.32 7.71,31.31 7.62,31.31 7.51,31.2 7.36,31.2
  Top 0.25: 7.36,31.2 J2.14 | 8.42,31.37 19.88,31.37 arc-90 20.46,30.79 arc90 20.7,30.55 21.78,30.55 arc90 22.02,30.79 arc-90 22.6,31.37 23.79,31.37 arc-90 24.37,30.79 arc90 24.61,30.55 24.88,30.55 arc90 25.12,30.79 arc-90 25.7,31.37 27.13,31.37 29.23,33.47 30.23,33.47 arc-90 30.8,32.89 arc90 31.04,32.66 31.78,32.66 arc90 32.02,32.89 arc-90 32.6,33.47 33.55,33.47 arc-90 34.13,32.89 arc90 34.37,32.66 35.28,32.66 arc90 35.52,32.89 arc-90 36.1,33.47 37.39,33.47 arc-90 37.97,32.89 arc90 38.2,32.66 38.78,32.66 arc90 39.02,32.89 arc-90 39.6,33.47 41.05,33.47 arc-90 41.62,32.89 arc90 41.86,32.66 42.78,32.66 arc90 43.02,32.89 arc-90 43.6,33.47 44.69,33.47 arc-90 45.26,32.89 arc90 45.5,32.66 46.28,32.66 arc90 46.52,32.89 arc-90 47.1,33.47 48.19,33.47 arc-90 48.77,32.89 arc90 49.01,32.66 49.78,32.66 arc90 50.02,32.89 arc-90 50.6,33.47 51.72,33.47 arc-90 52.3,32.89 arc90 52.53,32.66 53.28,32.66 arc90 53.52,32.89 arc-90 54.1,33.47 54.85,33.47 arc-90 55.42,32.89 arc90 55.66,32.66 56.28,32.66 arc90 56.52,32.89 arc-90 57.1,33.47 58.63,33.47 arc90 58.87,33.71 arc-90 59.11,33.95 59.29,33.95 arc-90 59.52,33.71 arc90 59.76,33.47 59.94,33.47 arc90 60.18,33.71 arc-90 60.42,33.95 60.6,33.95 arc-90 60.84,33.71 arc90 61.07,33.47 61.26,33.47 arc90 61.49,33.71 arc-90 61.73,33.95 61.91,33.95 arc-90 62.15,33.71 arc90 62.39,33.47 62.57,33.47 arc90 62.81,33.71 arc-90 63.04,33.95 63.22,33.95 arc-90 63.46,33.71 arc90 63.7,33.47 63.9,33.47 64.29,33.86 J4.H20
DOUT9_LVDS_P
  Top 0.14: 8.42,31.03 8.34,31.03 8.28,31.08 7.72,31.08 7.31,30.68 7.31,30.62 7.26,30.57
  Top 0.25: J4.H19 64.42,32.61 63.9,33.13 57.1,33.13 arc90 56.86,32.89 arc-90 56.28,32.31 55.66,32.31 arc-90 55.08,32.89 arc90 54.85,33.13 54.1,33.13 arc90 53.86,32.89 arc-90 53.28,32.31 52.53,32.31 arc-90 51.96,32.89 arc90 51.72,33.13 50.6,33.13 arc90 50.36,32.89 arc-90 49.78,32.31 49.01,32.31 arc-90 48.43,32.89 arc90 48.19,33.13 47.1,33.13 arc90 46.86,32.89 arc-90 46.28,32.31 45.5,32.31 arc-90 44.92,32.89 arc90 44.69,33.13 43.6,33.13 arc90 43.36,32.89 arc-90 42.78,32.31 41.86,32.31 arc-90 41.28,32.89 arc90 41.05,33.13 39.6,33.13 arc90 39.36,32.89 arc-90 38.78,32.31 38.2,32.31 arc-90 37.63,32.89 arc90 37.39,33.13 36.1,33.13 arc90 35.86,32.89 arc-90 35.28,32.31 34.37,32.31 arc-90 33.79,32.89 arc90 33.55,33.13 32.6,33.13 arc90 32.36,32.89 arc-90 31.78,32.31 31.04,32.31 arc-90 30.46,32.89 arc90 30.23,33.13 29.37,33.13 27.27,31.03 25.7,31.03 arc90 25.46,30.79 arc-90 24.88,30.21 24.61,30.21 arc-90 24.03,30.79 arc90 23.79,31.03 22.6,31.03 arc90 22.36,30.79 arc-90 21.78,30.21 20.7,30.21 arc-90 20.12,30.79 arc90 19.88,31.03 8.42,31.03 | J2.48 6.2,30.8 6.54,30.46 7.16,30.46 7.26,30.57
EX_CLK_LVDS_N
  Top 0.25: J4.H35 63.98,52.47 49.6,52.47 arc-90 49.36,52.71 49.36,52.77 arc90 49.12,53.01 49.01,53.01 arc90 48.77,52.77 48.77,52.71 arc-90 48.53,52.47 48.41,52.47 arc-90 48.17,52.71 48.17,52.77 arc90 47.94,53.01 47.82,53.01 arc90 47.58,52.77 47.58,52.71 arc-90 47.34,52.47 47.22,52.47 arc-90 46.99,52.71 46.99,52.77 arc90 46.75,53.01 46.63,53.01 arc90 46.39,52.77 46.39,52.71 arc-90 46.16,52.47 46.04,52.47 arc-90 45.8,52.71 45.8,52.77 arc90 45.56,53.01 45.44,53.01 arc90 45.21,52.77 45.21,52.71 arc-90 44.97,52.47 39.6,52.47 arc90 39.02,51.89 arc-90 38.78,51.66 38.51,51.66 arc-90 38.28,51.89 arc90 37.7,52.47 36.9,52.47 arc90 36.32,51.89 arc-90 36.08,51.66 35.65,51.66 arc-90 35.41,51.89 arc90 34.83,52.47 34,52.47 arc90 33.42,51.89 33.42,51.88 arc-90 33.18,51.64 32.95,51.64 arc-90 32.72,51.88 32.72,51.89 arc90 32.14,52.47 31.3,52.47 arc90 30.72,51.89 arc-90 30.48,51.66 29.97,51.66 arc-90 29.73,51.89 arc90 29.16,52.47 28.4,52.47 arc90 27.82,51.89 arc-90 27.58,51.66 27.18,51.66 arc-90 26.94,51.89 arc90 26.36,52.47 25.4,52.47 arc90 24.82,51.89 arc-90 24.58,51.66 24.35,51.66 arc-90 24.11,51.89 arc90 23.53,52.47 23.18,52.47 arc90 22.61,51.89 arc-90 22.37,51.66 21.81,51.66 arc-90 21.58,51.89 arc90 21,52.47 19.23,52.47 13.83,47.07 9.23,47.07 8.8,47.5 7.15,47.5 J2.34
EX_CLK_LVDS_P
  Top 0.14: 7.53,46.92 7.26,46.64 7.26,46.56
  Top 0.15: 7.53,46.92 7.59,46.97 7.59,47.03
  Top 0.25: J4.H34 63.94,52.13 39.6,52.13 arc90 39.36,51.89 arc-90 38.78,51.31 38.51,51.31 arc-90 37.94,51.89 arc90 37.7,52.13 36.9,52.13 arc90 36.66,51.89 arc-90 36.08,51.31 35.65,51.31 arc-90 35.07,51.89 arc90 34.83,52.13 34,52.13 arc90 33.76,51.89 33.76,51.88 arc-90 33.18,51.3 32.95,51.3 arc-90 32.38,51.88 32.38,51.89 arc90 32.14,52.13 31.3,52.13 arc90 31.06,51.89 arc-90 30.48,51.31 29.97,51.31 arc-90 29.39,51.89 arc90 29.16,52.13 28.4,52.13 arc90 28.16,51.89 arc-90 27.58,51.31 27.18,51.31 arc-90 26.6,51.89 arc90 26.36,52.13 25.4,52.13 arc90 25.16,51.89 arc-90 24.58,51.31 24.35,51.31 arc-90 23.77,51.89 arc90 23.53,52.13 23.18,52.13 arc90 22.95,51.89 arc-90 22.37,51.31 21.81,51.31 arc-90 21.24,51.89 arc90 21,52.13 19.37,52.13 13.97,46.73 8.8,46.73 8.39,47.14 7.69,47.14 7.59,47.03 | 7.26,46.56 7.16,46.46 6.47,46.46 6.13,46.8 J2.68
EX_IN_1ST_0_LVDS_N  (via drill 0.2)
  Top 0.25: J4.G34 65.44,51.65 v65.2,51.4
  Bottom 0.25: v65.2,51.4 65.2,51.37 65,51.17 47.6,51.17 arc-90 47.36,51.41 arc90 47.12,51.65 47.06,51.65 arc90 46.82,51.41 arc-90 46.58,51.17 46.52,51.17 arc-90 46.28,51.41 arc90 46.04,51.65 45.97,51.65 arc90 45.74,51.41 arc-90 45.5,51.17 45.43,51.17 arc-90 45.2,51.41 arc90 44.96,51.65 44.89,51.65 arc90 44.65,51.41 arc-90 44.42,51.17 44.35,51.17 arc-90 44.11,51.41 arc90 43.87,51.65 43.81,51.65 arc90 43.57,51.41 arc-90 43.33,51.17 43.27,51.17 arc-90 43.03,51.41 arc90 42.79,51.65 42.72,51.65 arc90 42.49,51.41 arc-90 42.25,51.17 42.18,51.17 arc-90 41.95,51.41 arc90 41.71,51.65 41.64,51.65 arc90 41.4,51.41 arc-90 41.17,51.17 37.8,51.17 arc90 37.22,50.59 arc-90 36.98,50.35 36.38,50.35 arc-90 36.14,50.59 arc90 35.56,51.17 35.1,51.17 arc90 34.52,50.59 arc-90 34.28,50.35 33.82,50.35 arc-90 33.58,50.59 arc90 33,51.17 32.5,51.17 arc90 31.92,50.59 31.92,50.58 arc-90 31.68,50.34 31.07,50.34 arc-90 30.83,50.58 30.83,50.59 arc90 30.25,51.17 29.6,51.17 arc90 29.02,50.59 29.02,50.58 arc-90 28.78,50.34 27.94,50.34 arc-90 27.71,50.58 27.71,50.59 arc90 27.13,51.17 26.4,51.17 arc90 25.82,50.59 arc-90 25.58,50.35 25.41,50.35 arc-90 25.17,50.59 arc90 24.6,51.17 24.1,51.17 arc90 23.52,50.59 arc-90 23.28,50.35 22.78,50.35 arc-90 22.55,50.59 arc90 21.97,51.17 20.53,51.17 14.13,44.77 8.03,44.77 J2.31
EX_IN_1ST_0_LVDS_P  (via drill 0.2)
  Top 0.25: J4.G33 65.69,50.41 v65.3,50.8
  Bottom 0.14: 7.59,43.84 7.53,43.76 7.53,43.72 7.5,43.67 7.31,43.48 7.31,43.44 7.26,43.37
  Bottom 0.25: 65.27,50.83 v65.3,50.8 65.3,50.83 37.8,50.83 arc90 37.56,50.59 arc-90 36.98,50.02 36.38,50.02 arc-90 35.8,50.59 arc90 35.56,50.83 35.1,50.83 arc90 34.86,50.59 arc-90 34.28,50.02 33.82,50.02 arc-90 33.24,50.59 arc90 33,50.83 32.5,50.83 arc90 32.26,50.59 32.26,50.58 arc-90 31.68,50 31.07,50 arc-90 30.49,50.58 30.49,50.59 arc90 30.25,50.83 29.6,50.83 arc90 29.36,50.59 29.36,50.58 arc-90 28.78,50 27.94,50 arc-90 27.37,50.58 27.37,50.59 arc90 27.13,50.83 26.4,50.83 arc90 26.16,50.59 arc-90 25.58,50.02 25.41,50.02 arc-90 24.83,50.59 arc90 24.6,50.83 24.1,50.83 arc90 23.86,50.59 arc-90 23.28,50.02 22.78,50.02 arc-90 22.21,50.59 arc90 21.97,50.83 20.67,50.83 14.27,44.43 8.68,44.43 8.31,44.06 7.81,44.06 7.59,43.84 | 5.73,44.43 J2.65 6.11,43.99 6.11,43.69 6.54,43.26 7.16,43.26 7.26,43.37
EX_IN_1ST_1_LVDS_N  (via drill 0.2)
  Top 0.25: J4.G37 65.55,55.45 v65.2,55.1
  Bottom 0.14: 8.6,45.77 8.5,45.8 8.36,45.79 8.28,45.72 8.27,45.72 7.62,45.72 7.53,45.63 7.3,45.6
  Bottom 0.25: v65.2,55.1 65.05,54.95 65.01,54.95 64.93,54.87 44.4,54.87 arc-90 44.16,55.11 arc90 43.92,55.34 43.86,55.34 arc90 43.63,55.11 arc-90 43.39,54.87 43.33,54.87 arc-90 43.09,55.11 arc90 42.85,55.34 42.79,55.34 arc90 42.55,55.11 arc-90 42.32,54.87 42.26,54.87 arc-90 42.02,55.11 arc90 41.78,55.34 41.72,55.34 arc90 41.48,55.11 arc-90 41.24,54.87 41.18,54.87 arc-90 40.95,55.11 arc90 40.71,55.34 40.65,55.34 arc90 40.41,55.11 arc-90 40.17,54.87 32,54.87 arc90 31.42,54.29 arc-90 31.18,54.05 30.47,54.05 arc-90 30.24,54.29 arc90 29.66,54.87 29.2,54.87 arc90 28.62,54.29 arc-90 28.38,54.05 27.86,54.05 arc-90 27.62,54.29 arc90 27.05,54.87 26.6,54.87 arc90 26.02,54.29 arc-90 25.78,54.05 25.22,54.05 arc-90 24.98,54.29 arc90 24.4,54.87 24,54.87 arc90 23.42,54.29 arc-90 23.18,54.05 22.87,54.05 arc-90 22.63,54.29 arc90 22.05,54.87 21.6,54.87 arc90 21.02,54.29 arc-90 20.78,54.05 20.5,54.05 arc-90 20.26,54.29 arc90 19.69,54.87 17.83,54.87 8.73,45.77 8.6,45.77 8.42,45.77 | 7.3,45.6 J2.32
EX_IN_1ST_1_LVDS_P  (via drill 0.2)
  Top 0.25: J4.G36 65.61,54.19 65.3,54.5 v65.2,54.5
  Bottom 0.14: 8.42,45.43 8.34,45.43 8.28,45.48 7.72,45.48 7.65,45.42 7.6,45.4 7.49,45.26 7.31,45.08 7.31,45.03 7.26,44.97
  Bottom 0.25: v65.2,54.5 65.17,54.53 32,54.53 arc90 31.76,54.29 arc-90 31.18,53.72 30.47,53.72 arc-90 29.9,54.29 arc90 29.66,54.53 29.2,54.53 arc90 28.96,54.29 arc-90 28.38,53.72 27.86,53.72 arc-90 27.28,54.29 arc90 27.05,54.53 26.6,54.53 arc90 26.36,54.29 arc-90 25.78,53.72 25.22,53.72 arc-90 24.64,54.29 arc90 24.4,54.53 24,54.53 arc90 23.76,54.29 arc-90 23.18,53.72 22.87,53.72 arc-90 22.29,54.29 arc90 22.05,54.53 21.6,54.53 arc90 21.36,54.29 arc-90 20.78,53.72 20.5,53.72 arc-90 19.92,54.29 arc90 19.69,54.53 17.97,54.53 8.87,45.43 8.42,45.43 | J2.66 6.2,45.2 6.54,44.86 7.16,44.86 7.26,44.97
EX_IN_2ND_0_LVDS_N  (via drill 0.2)
  Top 0.25: 65.83,47.84 J4.G31 65.62,47.84 v65.27,47.48
  Bottom 0.14: 8.65,42.47 8.43,42.47 8.33,42.57 8.28,42.52 7.58,42.52 7.56,42.54
  Bottom 0.25: 8.65,42.47 16.63,42.47 18.98,44.82 | v65.27,47.48 65.14,47.35 65.11,47.35 64.93,47.17 59.3,47.17 arc-90 59.06,47.41 arc90 58.82,47.65 58.11,47.65 arc90 57.87,47.41 arc-90 57.64,47.17 56.4,47.17 arc-90 56.16,47.41 arc90 55.92,47.65 55.82,47.65 arc90 55.59,47.41 arc-90 55.35,47.17 55.25,47.17 arc-90 55.01,47.41 arc90 54.77,47.65 54.67,47.65 arc90 54.44,47.41 arc-90 54.2,47.17 54.1,47.17 arc-90 53.86,47.41 arc90 53.63,47.65 53.53,47.65 arc90 53.29,47.41 arc-90 53.05,47.17 45.5,47.17 arc90 44.92,46.59 arc-90 44.68,46.35 44.19,46.35 arc-90 43.95,46.59 arc90 43.37,47.17 42.3,47.17 arc90 41.72,46.59 arc-90 41.48,46.35 41.18,46.35 arc-90 40.95,46.59 arc90 40.37,47.17 39.8,47.17 arc90 39.22,46.59 arc-90 38.98,46.35 38.39,46.35 arc-90 38.15,46.59 arc90 37.58,47.17 36.6,47.17 arc90 36.02,46.59 36.02,46.58 arc-90 35.78,46.34 35.26,46.34 arc-90 35.02,46.58 35.02,46.59 arc90 34.44,47.17 33.1,47.17 arc90 32.52,46.59 32.52,46.58 arc-90 32.28,46.34 31.69,46.34 arc-90 31.45,46.58 31.45,46.59 arc90 30.87,47.17 29.6,47.17 arc90 29.02,46.59 29.02,46.58 arc-90 28.78,46.34 28.05,46.34 arc-90 27.81,46.58 27.81,46.59 arc90 27.23,47.17 26.1,47.17 arc90 25.52,46.59 arc-90 25.28,46.35 24.79,46.35 arc-90 24.55,46.59 arc90 23.97,47.17 21.33,47.17 18.98,44.82 | J2.28 7.05,42.6 7.5,42.6 7.56,42.54 | 18.98,44.82
EX_IN_2ND_0_LVDS_P  (via drill 0.2)
  Top 0.25: 65.83,46.56 J4.G30 65.36,46.9 v65.3,46.9
  Bottom 0.14: 7.26,41.77 7.31,41.82 7.31,41.88 7.72,42.28 8.28,42.28 8.44,42.13 8.65,42.13
  Bottom 0.25: 8.65,42.13 16.77,42.13 19.22,44.58 | v65.3,46.9 65.23,46.83 45.5,46.83 arc90 45.26,46.59 arc-90 44.68,46.02 44.19,46.02 arc-90 43.61,46.59 arc90 43.37,46.83 42.3,46.83 arc90 42.06,46.59 arc-90 41.48,46.02 41.18,46.02 arc-90 40.61,46.59 arc90 40.37,46.83 39.8,46.83 arc90 39.56,46.59 arc-90 38.98,46.02 38.39,46.02 arc-90 37.81,46.59 arc90 37.58,46.83 36.6,46.83 arc90 36.36,46.59 36.36,46.58 arc-90 35.78,46 35.26,46 arc-90 34.68,46.58 34.68,46.59 arc90 34.44,46.83 33.1,46.83 arc90 32.86,46.59 32.86,46.58 arc-90 32.28,46 31.69,46 arc-90 31.11,46.58 31.11,46.59 arc90 30.87,46.83 29.6,46.83 arc90 29.36,46.59 29.36,46.58 arc-90 28.78,46 28.05,46 arc-90 27.47,46.58 27.47,46.59 arc90 27.23,46.83 26.1,46.83 arc90 25.86,46.59 arc-90 25.28,46.02 24.79,46.02 arc-90 24.21,46.59 arc90 23.97,46.83 21.47,46.83 19.22,44.58 | J2.62 6.2,42 6.54,41.66 7.16,41.66 7.26,41.77 | 19.22,44.58
EX_IN_2ND_1_LVDS_N
  Top 0.25: J2.29 8.86,43.2 9.43,43.77 15.23,43.77 20.13,48.67 21.65,48.67 arc-90 22.23,48.09 arc90 22.47,47.85 23.28,47.85 arc90 23.52,48.09 arc-90 24.1,48.67 25.53,48.67 arc-90 26.11,48.09 26.11,48.08 arc90 26.35,47.84 27.28,47.84 arc90 27.52,48.08 27.52,48.09 arc-90 28.1,48.67 29.25,48.67 arc-90 29.83,48.09 29.83,48.08 arc90 30.07,47.84 30.78,47.84 arc90 31.02,48.08 31.02,48.09 arc-90 31.6,48.67 33.17,48.67 arc-90 33.75,48.09 arc90 33.99,47.85 34.78,47.85 arc90 35.02,48.09 arc-90 35.6,48.67 36.98,48.67 arc-90 37.56,48.09 37.56,48.08 arc90 37.79,47.84 38.78,47.84 arc90 39.02,48.08 39.02,48.09 arc-90 39.6,48.67 40.62,48.67 arc-90 41.2,48.09 41.2,48.08 arc90 41.43,47.84 42.28,47.84 arc90 42.52,48.08 42.52,48.09 arc-90 43.1,48.67 44.32,48.67 arc-90 44.89,48.09 44.89,48.08 arc90 45.13,47.84 45.78,47.84 arc90 46.02,48.08 46.02,48.09 arc-90 46.6,48.67 47.15,48.67 arc-90 47.73,48.09 arc90 47.97,47.85 48.78,47.85 arc90 49.02,48.09 arc-90 49.6,48.67 50.22,48.67 arc90 50.46,48.91 arc-90 50.7,49.15 50.71,49.15 arc-90 50.94,48.91 arc90 51.18,48.67 51.19,48.67 arc90 51.43,48.91 arc-90 51.67,49.15 51.68,49.15 arc-90 51.92,48.91 arc90 52.15,48.67 52.17,48.67 arc90 52.4,48.91 arc-90 52.64,49.15 52.65,49.15 arc-90 52.89,48.91 arc90 53.13,48.67 53.14,48.67 arc90 53.38,48.91 arc-90 53.61,49.15 53.62,49.15 arc-90 53.86,48.91 arc90 54.1,48.67 55.13,48.67 arc-90 55.71,48.09 arc90 55.94,47.85 56.88,47.85 arc90 57.12,48.09 arc-90 57.7,48.67 63.7,48.67 64.13,49.1 J4.H32
EX_IN_2ND_1_LVDS_P
  Top 0.14: 8.67,42.8 8.38,42.52 7.72,42.52 7.26,42.97 7.26,43.04
  Top 0.25: 8.67,42.8 8.94,42.8 9.57,43.43 15.37,43.43 20.27,48.33 21.65,48.33 arc-90 21.89,48.09 arc90 22.47,47.52 23.28,47.52 arc90 23.86,48.09 arc-90 24.1,48.33 25.53,48.33 arc-90 25.77,48.09 25.77,48.08 arc90 26.35,47.5 27.28,47.5 arc90 27.86,48.08 27.86,48.09 arc-90 28.1,48.33 29.25,48.33 arc-90 29.49,48.09 29.49,48.08 arc90 30.07,47.5 30.78,47.5 arc90 31.36,48.08 31.36,48.09 arc-90 31.6,48.33 33.17,48.33 arc-90 33.41,48.09 arc90 33.99,47.52 34.78,47.52 arc90 35.36,48.09 arc-90 35.6,48.33 36.98,48.33 arc-90 37.22,48.09 37.22,48.08 arc90 37.79,47.5 38.78,47.5 arc90 39.36,48.08 39.36,48.09 arc-90 39.6,48.33 40.62,48.33 arc-90 40.86,48.09 40.86,48.08 arc90 41.43,47.5 42.28,47.5 arc90 42.86,48.08 42.86,48.09 arc-90 43.1,48.33 44.32,48.33 arc-90 44.55,48.09 44.55,48.08 arc90 45.13,47.5 45.78,47.5 arc90 46.36,48.08 46.36,48.09 arc-90 46.6,48.33 47.15,48.33 arc-90 47.39,48.09 arc90 47.97,47.52 48.78,47.52 arc90 49.36,48.09 arc-90 49.6,48.33 55.13,48.33 arc-90 55.37,48.09 arc90 55.94,47.52 56.88,47.52 arc90 57.46,48.09 arc-90 57.7,48.33 63.7,48.33 64.19,47.84 J4.H31 | J2.63 6.1,43.2 7.1,43.2 7.26,43.04
EX_SHIFT_ENB_LVDS_N
  Top 0.25: J2.23 8.03,38.37 20.53,38.37 24.23,42.07 25.59,42.07 arc-90 26.16,41.49 arc90 26.4,41.26 27.28,41.26 arc90 27.52,41.49 arc-90 28.1,42.07 29.23,42.07 arc-90 29.81,41.49 arc90 30.05,41.26 30.78,41.26 arc90 31.02,41.49 arc-90 31.6,42.07 32.72,42.07 arc-90 33.29,41.49 arc90 33.53,41.26 34.28,41.26 arc90 34.52,41.49 arc-90 35.1,42.07 36.19,42.07 arc-90 36.77,41.49 arc90 37,41.26 37.78,41.26 arc90 38.02,41.49 arc-90 38.6,42.07 39.9,42.07 arc-90 40.48,41.49 arc90 40.72,41.26 41.28,41.26 arc90 41.52,41.49 arc-90 42.1,42.07 43.29,42.07 arc-90 43.86,41.49 arc90 44.1,41.26 44.78,41.26 arc90 45.02,41.49 arc-90 45.6,42.07 46.47,42.07 arc-90 47.05,41.49 arc90 47.28,41.26 47.78,41.26 arc90 48.02,41.49 arc-90 48.6,42.07 49.98,42.07 arc-90 50.56,41.49 arc90 50.8,41.26 51.78,41.26 arc90 52.02,41.49 arc-90 52.6,42.07 56.41,42.07 arc90 56.64,42.31 arc-90 56.88,42.55 56.94,42.55 arc-90 57.18,42.31 arc90 57.41,42.07 57.47,42.07 arc90 57.71,42.31 arc-90 57.94,42.55 58,42.55 arc-90 58.24,42.31 arc90 58.47,42.07 58.53,42.07 arc90 58.77,42.31 arc-90 59.01,42.55 59.06,42.55 arc-90 59.3,42.31 arc90 59.54,42.07 59.59,42.07 arc90 59.83,42.31 arc-90 60.07,42.55 60.12,42.55 arc-90 60.36,42.31 arc90 60.6,42.07 62.8,42.07 64.09,43.36 64.73,43.36 64.91,43.54 65.21,43.54 J4.G28
EX_SHIFT_ENB_LVDS_P
  Top 0.14: 7.26,38.23 7.31,38.18 7.31,38.12 7.59,37.84 7.59,37.77
  Top 0.25: J2.57 6.2,38 6.54,38.34 7.16,38.34 7.26,38.23 | 7.59,37.77 7.69,37.66 8.31,37.66 8.68,38.03 20.67,38.03 24.37,41.73 25.59,41.73 arc-90 25.82,41.49 arc90 26.4,40.91 27.28,40.91 arc90 27.86,41.49 arc-90 28.1,41.73 29.23,41.73 arc-90 29.47,41.49 arc90 30.05,40.91 30.78,40.91 arc90 31.36,41.49 arc-90 31.6,41.73 32.72,41.73 arc-90 32.95,41.49 arc90 33.53,40.91 34.28,40.91 arc90 34.86,41.49 arc-90 35.1,41.73 36.19,41.73 arc-90 36.43,41.49 arc90 37,40.91 37.78,40.91 arc90 38.36,41.49 arc-90 38.6,41.73 39.9,41.73 arc-90 40.14,41.49 arc90 40.72,40.91 41.28,40.91 arc90 41.86,41.49 arc-90 42.1,41.73 43.29,41.73 arc-90 43.52,41.49 arc90 44.1,40.91 44.78,40.91 arc90 45.36,41.49 arc-90 45.6,41.73 46.47,41.73 arc-90 46.71,41.49 arc90 47.28,40.91 47.78,40.91 arc90 48.36,41.49 arc-90 48.6,41.73 49.98,41.73 arc-90 50.22,41.49 arc90 50.8,40.91 51.78,40.91 arc90 52.36,41.49 arc-90 52.6,41.73 63.1,41.73 63.55,42.19 64.66,42.19 65.09,42.61 65.55,42.61 J4.G27
EX_VALUE_O0_N
  Top 0.14: 8.42,36.17 8.34,36.17 8.28,36.12 7.54,36.12
  Top 0.25: J4.G25 65.69,40.2 65.14,39.64 64.81,39.64 64.77,39.6 64.13,39.6 63.7,39.17 59.6,39.17 arc-90 59.36,39.41 arc90 59.12,39.65 59.07,39.65 arc90 58.83,39.41 arc-90 58.59,39.17 58.53,39.17 arc-90 58.3,39.41 arc90 58.06,39.65 58,39.65 arc90 57.77,39.41 arc-90 57.53,39.17 57.47,39.17 arc-90 57.23,39.41 arc90 57,39.65 56.94,39.65 arc90 56.7,39.41 arc-90 56.46,39.17 56.41,39.17 arc-90 56.17,39.41 arc90 55.93,39.65 55.87,39.65 arc90 55.64,39.41 arc-90 55.4,39.17 55.34,39.17 arc-90 55.1,39.41 arc90 54.87,39.65 54.81,39.65 arc90 54.57,39.41 arc-90 54.33,39.17 52.6,39.17 arc90 52.02,38.59 arc-90 51.78,38.35 51.56,38.35 arc-90 51.32,38.59 arc90 50.74,39.17 49.6,39.17 arc90 49.02,38.59 arc-90 48.78,38.35 48.06,38.35 arc-90 47.82,38.59 arc90 47.24,39.17 46.1,39.17 arc90 45.52,38.59 45.52,38.58 arc-90 45.28,38.34 44.18,38.34 arc-90 43.94,38.58 43.94,38.59 arc90 43.36,39.17 42.1,39.17 arc90 41.52,38.59 41.52,38.58 arc-90 41.28,38.34 40.27,38.34 arc-90 40.04,38.58 40.04,38.59 arc90 39.46,39.17 38.1,39.17 arc90 37.52,38.59 arc-90 37.28,38.35 36.19,38.35 arc-90 35.95,38.59 arc90 35.37,39.17 34.1,39.17 arc90 33.52,38.59 33.52,38.58 arc-90 33.28,38.34 32.08,38.34 arc-90 31.85,38.58 31.85,38.59 arc90 31.27,39.17 30.1,39.17 arc90 29.52,38.59 29.52,38.58 arc-90 29.28,38.34 28.38,38.34 arc-90 28.14,38.58 28.14,38.59 arc90 27.56,39.17 26.33,39.17 23.33,36.17 8.42,36.17 | J2.20 6.96,36.12 7.54,36.12
EX_VALUE_O0_P
  Top 0.14: 8.42,35.83 8.34,35.83 8.28,35.88 7.72,35.88 7.31,35.48 7.31,35.42 7.16,35.26